# Altium project RK3399_SOM_BOARD.PrjPcb (part 2 of 4)

## Sheet RK3399_SDRAM.SchDoc
size A3; Date: 07.08.2025; CheckedBy: Own Check; CompanyName: No Company; DocumentNumber: ELK.PCB.0005.0005.A.A; Revision: V0.0.1; SheetNumber: 9; SheetTotal: 22
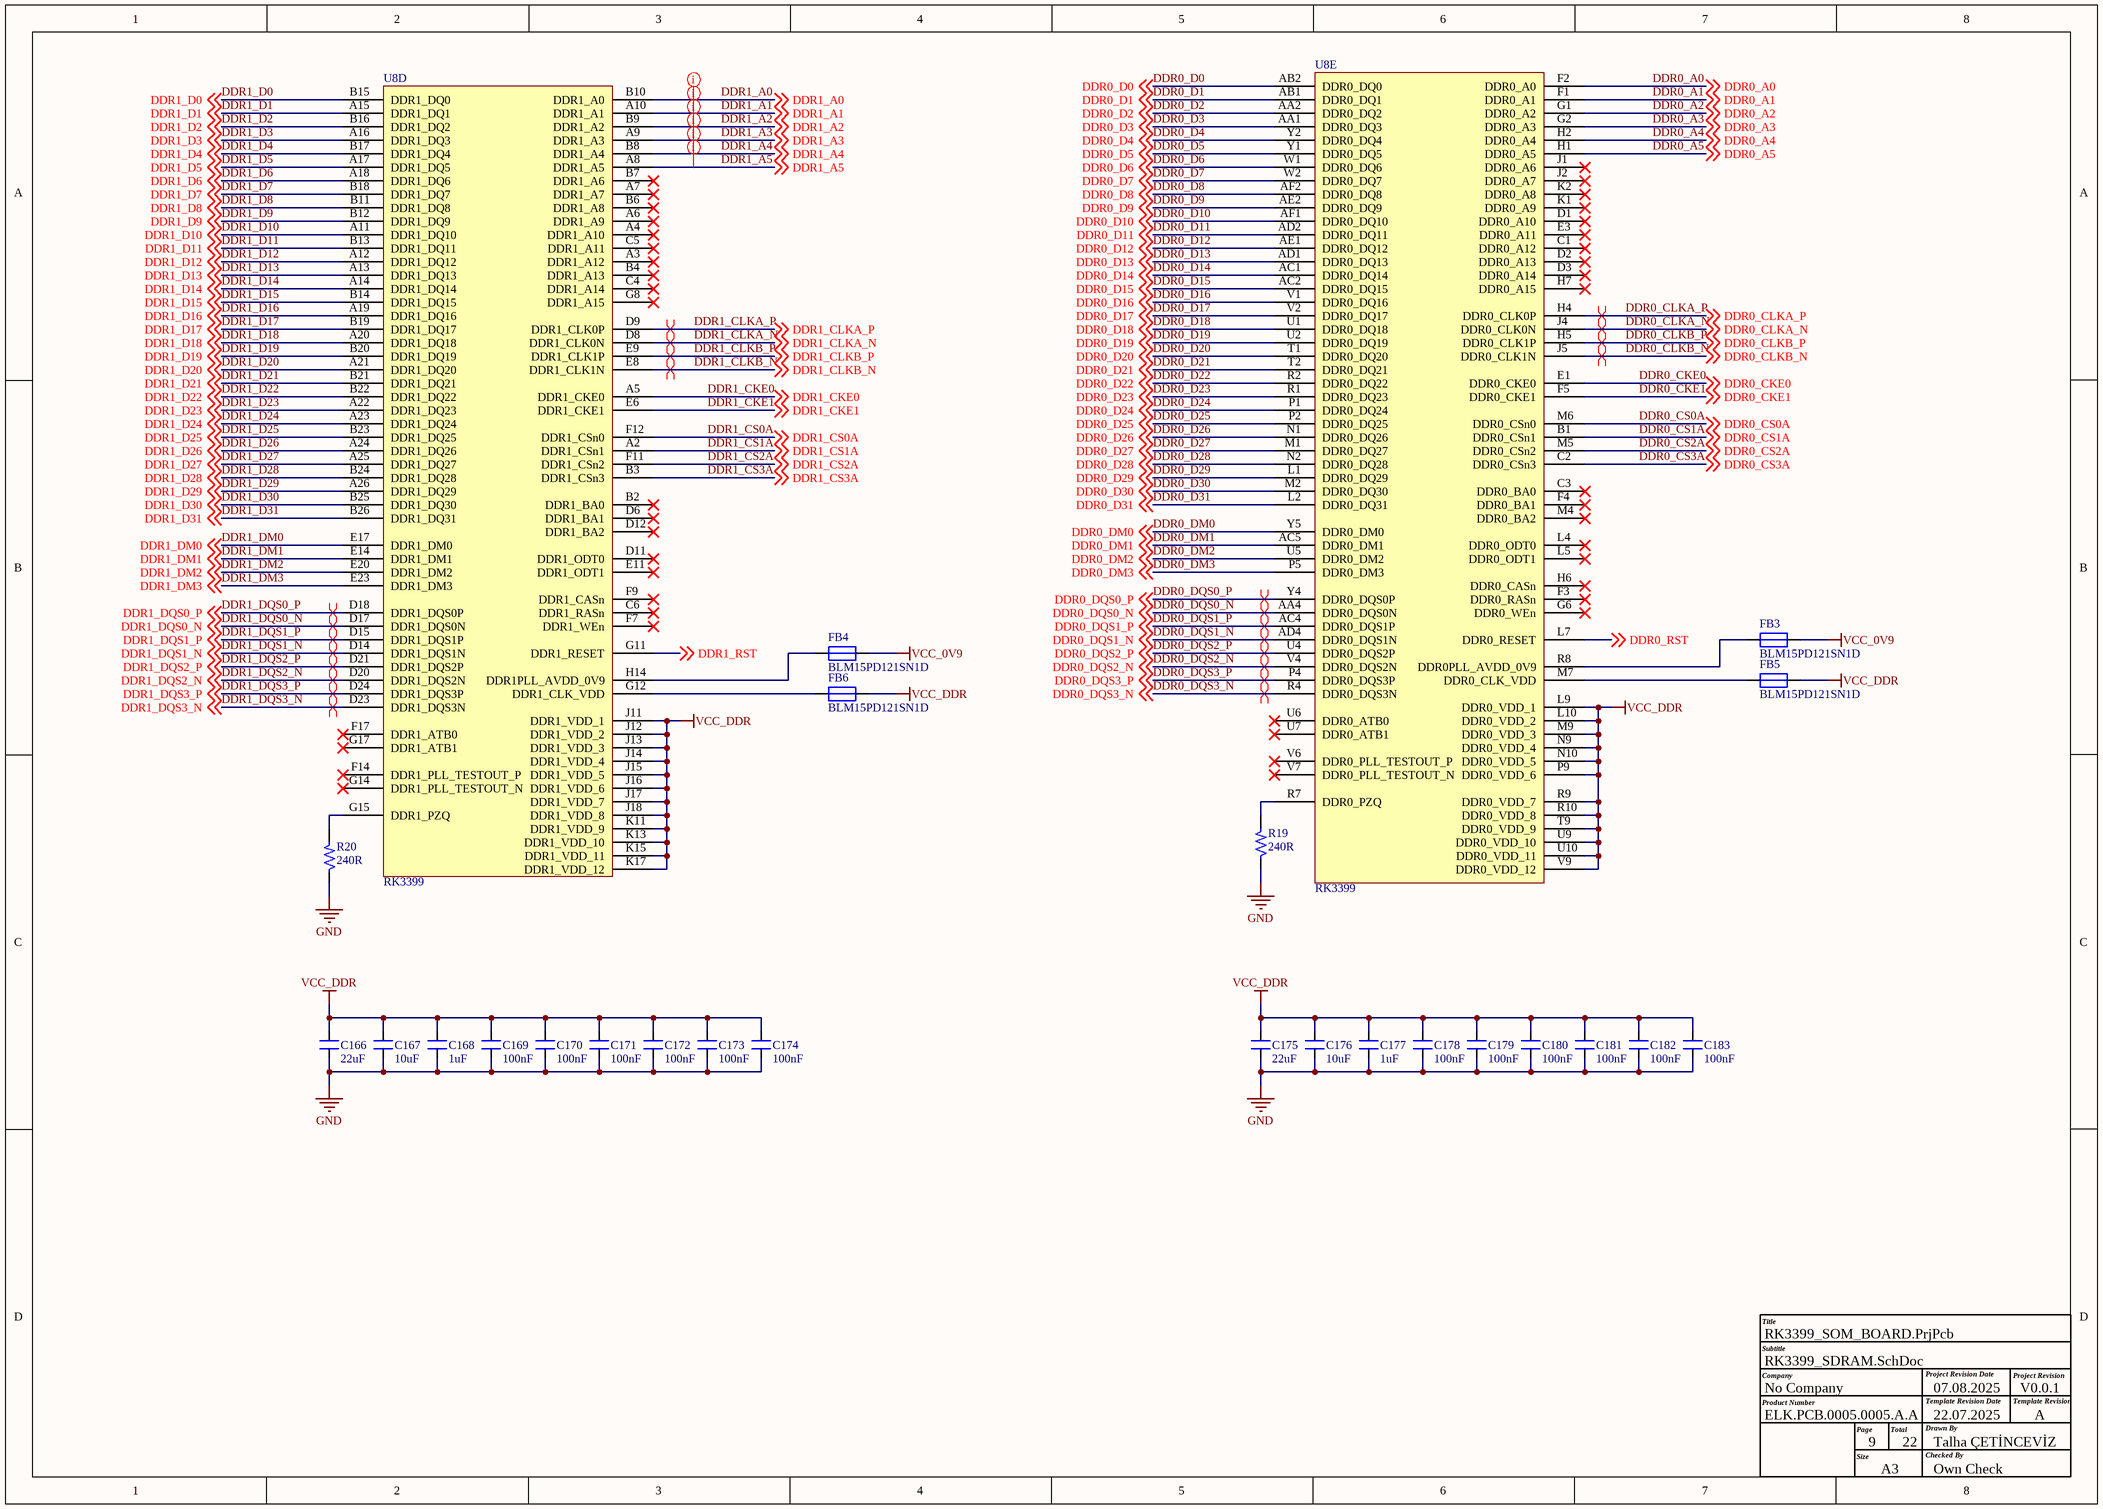
[diagram p7: RK3399_SDRAM.SchDoc]

### Parts
C166  22uF  [CAP_0402]
C167  10uF  [CAP_0402]
C168  1uF  [CAP_0201]
C169  100nF  [CAP_0201]
C170  100nF  [CAP_0201]
C171  100nF  [CAP_0201]
C172  100nF  [CAP_0201]
C173  100nF  [CAP_0201]
C174  100nF  [CAP_0201]
C175  22uF  [CAP_0402]
C176  10uF  [CAP_0402]
C177  1uF  [CAP_0201]
C178  100nF  [CAP_0201]
C179  100nF  [CAP_0201]
C180  100nF  [CAP_0201]
C181  100nF  [CAP_0201]
C182  100nF  [CAP_0201]
C183  100nF  [CAP_0201]
FB3  BLM15PD121SN1D  [RES_0402]
FB4  BLM15PD121SN1D  [RES_0402]
FB5  BLM15PD121SN1D  [RES_0402]
FB6  BLM15PD121SN1D  [RES_0402]
R19  240R  [RES_0201]
R20  240R  [RES_0201]
U8  RK3399  [FBGA828_23_826X826]  (parts D,E of 24)

### Nets
GND: C166.1 C167.1 C168.1 C169.1 C170.1 C171.1 C172.1 C173.1 C174.1 C175.1 C176.1 C177.1 C178.1 C179.1 C180.1 C181.1 C182.1 C183.1 R19.1 R20.1
VCC_0V9: FB3.2 FB4.2
VCC_DDR: C166.2 C167.2 C168.2 C169.2 C170.2 C171.2 C172.2 C173.2 C174.2 C175.2 C176.2 C177.2 C178.2 C179.2 C180.2 C181.2 C182.2 C183.2 FB5.2 FB6.2 U8.J11(DDR1_VDD_1) U8.J12(DDR1_VDD_2) U8.J13(DDR1_VDD_3) U8.J14(DDR1_VDD_4) U8.J15(DDR1_VDD_5) U8.J16(DDR1_VDD_6) U8.J17(DDR1_VDD_7) U8.J18(DDR1_VDD_8) U8.K11(DDR1_VDD_9) U8.K13(DDR1_VDD_10) U8.K15(DDR1_VDD_11) U8.K17(DDR1_VDD_12) U8.L9(DDR0_VDD_1) U8.L10(DDR0_VDD_2) U8.M9(DDR0_VDD_3) U8.N9(DDR0_VDD_4) U8.N10(DDR0_VDD_5) U8.P9(DDR0_VDD_6) U8.R9(DDR0_VDD_7) U8.R10(DDR0_VDD_8) U8.T9(DDR0_VDD_9) U8.U9(DDR0_VDD_10) U8.U10(DDR0_VDD_11) U8.V9(DDR0_VDD_12)
DDR0_A0: U8.F2(DDR0_A0) ; off-sheet DDR0_A0
DDR0_A1: U8.F1(DDR0_A1) ; off-sheet DDR0_A1
DDR0_A2: U8.G1(DDR0_A2) ; off-sheet DDR0_A2
DDR0_A3: U8.G2(DDR0_A3) ; off-sheet DDR0_A3
DDR0_A4: U8.H2(DDR0_A4) ; off-sheet DDR0_A4
DDR0_A5: U8.H1(DDR0_A5) ; off-sheet DDR0_A5
DDR0_CKE0: U8.E1(DDR0_CKE0) ; off-sheet DDR0_CKE0
DDR0_CKE1: U8.F5(DDR0_CKE1) ; off-sheet DDR0_CKE1
DDR0_CLKA_N: U8.J4(DDR0_CLK0N) ; off-sheet DDR0_CLKA_N
DDR0_CLKA_P: U8.H4(DDR0_CLK0P) ; off-sheet DDR0_CLKA_P
DDR0_CLKB_N: U8.J5(DDR0_CLK1N) ; off-sheet DDR0_CLKB_N
DDR0_CLKB_P: U8.H5(DDR0_CLK1P) ; off-sheet DDR0_CLKB_P
DDR0_CS0A: U8.M6(DDR0_CSn0) ; off-sheet DDR0_CS0A
DDR0_CS1A: U8.B1(DDR0_CSn1) ; off-sheet DDR0_CS1A
DDR0_CS2A: U8.M5(DDR0_CSn2) ; off-sheet DDR0_CS2A
DDR0_CS3A: U8.C2(DDR0_CSn3) ; off-sheet DDR0_CS3A
DDR0_D0: U8.AB2(DDR0_DQ0) ; off-sheet DDR0_D0
DDR0_D1: U8.AB1(DDR0_DQ1) ; off-sheet DDR0_D1
DDR0_D2: U8.AA2(DDR0_DQ2) ; off-sheet DDR0_D2
DDR0_D3: U8.AA1(DDR0_DQ3) ; off-sheet DDR0_D3
DDR0_D4: U8.Y2(DDR0_DQ4) ; off-sheet DDR0_D4
DDR0_D5: U8.Y1(DDR0_DQ5) ; off-sheet DDR0_D5
DDR0_D6: U8.W1(DDR0_DQ6) ; off-sheet DDR0_D6
DDR0_D7: U8.W2(DDR0_DQ7) ; off-sheet DDR0_D7
DDR0_D8: U8.AF2(DDR0_DQ8) ; off-sheet DDR0_D8
DDR0_D9: U8.AE2(DDR0_DQ9) ; off-sheet DDR0_D9
DDR0_D10: U8.AF1(DDR0_DQ10) ; off-sheet DDR0_D10
DDR0_D11: U8.AD2(DDR0_DQ11) ; off-sheet DDR0_D11
DDR0_D12: U8.AE1(DDR0_DQ12) ; off-sheet DDR0_D12
DDR0_D13: U8.AD1(DDR0_DQ13) ; off-sheet DDR0_D13
DDR0_D14: U8.AC1(DDR0_DQ14) ; off-sheet DDR0_D14
DDR0_D15: U8.AC2(DDR0_DQ15) ; off-sheet DDR0_D15
DDR0_D16: U8.V1(DDR0_DQ16) ; off-sheet DDR0_D16
DDR0_D17: U8.V2(DDR0_DQ17) ; off-sheet DDR0_D17
DDR0_D18: U8.U1(DDR0_DQ18) ; off-sheet DDR0_D18
DDR0_D19: U8.U2(DDR0_DQ19) ; off-sheet DDR0_D19
DDR0_D20: U8.T1(DDR0_DQ20) ; off-sheet DDR0_D20
DDR0_D21: U8.T2(DDR0_DQ21) ; off-sheet DDR0_D21
DDR0_D22: U8.R2(DDR0_DQ22) ; off-sheet DDR0_D22
DDR0_D23: U8.R1(DDR0_DQ23) ; off-sheet DDR0_D23
DDR0_D24: U8.P1(DDR0_DQ24) ; off-sheet DDR0_D24
DDR0_D25: U8.P2(DDR0_DQ25) ; off-sheet DDR0_D25
DDR0_D26: U8.N1(DDR0_DQ26) ; off-sheet DDR0_D26
DDR0_D27: U8.M1(DDR0_DQ27) ; off-sheet DDR0_D27
DDR0_D28: U8.N2(DDR0_DQ28) ; off-sheet DDR0_D28
DDR0_D29: U8.L1(DDR0_DQ29) ; off-sheet DDR0_D29
DDR0_D30: U8.M2(DDR0_DQ30) ; off-sheet DDR0_D30
DDR0_D31: U8.L2(DDR0_DQ31) ; off-sheet DDR0_D31
DDR0_DM0: U8.Y5(DDR0_DM0) ; off-sheet DDR0_DM0
DDR0_DM1: U8.AC5(DDR0_DM1) ; off-sheet DDR0_DM1
DDR0_DM2: U8.U5(DDR0_DM2) ; off-sheet DDR0_DM2
DDR0_DM3: U8.P5(DDR0_DM3) ; off-sheet DDR0_DM3
DDR0_DQS0_N: U8.AA4(DDR0_DQS0N) ; off-sheet DDR0_DQS0_N
DDR0_DQS0_P: U8.Y4(DDR0_DQS0P) ; off-sheet DDR0_DQS0_P
DDR0_DQS1_N: U8.AD4(DDR0_DQS1N) ; off-sheet DDR0_DQS1_N
DDR0_DQS1_P: U8.AC4(DDR0_DQS1P) ; off-sheet DDR0_DQS1_P
DDR0_DQS2_N: U8.V4(DDR0_DQS2N) ; off-sheet DDR0_DQS2_N
DDR0_DQS2_P: U8.U4(DDR0_DQS2P) ; off-sheet DDR0_DQS2_P
DDR0_DQS3_N: U8.R4(DDR0_DQS3N) ; off-sheet DDR0_DQS3_N
DDR0_DQS3_P: U8.P4(DDR0_DQS3P) ; off-sheet DDR0_DQS3_P
DDR0_RST: U8.L7(DDR0_RESET) ; off-sheet DDR0_RST
DDR1_A0: U8.B10(DDR1_A0) ; off-sheet DDR1_A0
DDR1_A1: U8.A10(DDR1_A1) ; off-sheet DDR1_A1
DDR1_A2: U8.B9(DDR1_A2) ; off-sheet DDR1_A2
DDR1_A3: U8.A9(DDR1_A3) ; off-sheet DDR1_A3
DDR1_A4: U8.B8(DDR1_A4) ; off-sheet DDR1_A4
DDR1_A5: U8.A8(DDR1_A5) ; off-sheet DDR1_A5
DDR1_CKE0: U8.A5(DDR1_CKE0) ; off-sheet DDR1_CKE0
DDR1_CKE1: U8.E6(DDR1_CKE1) ; off-sheet DDR1_CKE1
DDR1_CLKA_N: U8.D8(DDR1_CLK0N) ; off-sheet DDR1_CLKA_N
DDR1_CLKA_P: U8.D9(DDR1_CLK0P) ; off-sheet DDR1_CLKA_P
DDR1_CLKB_N: U8.E8(DDR1_CLK1N) ; off-sheet DDR1_CLKB_N
DDR1_CLKB_P: U8.E9(DDR1_CLK1P) ; off-sheet DDR1_CLKB_P
DDR1_CS0A: U8.F12(DDR1_CSn0) ; off-sheet DDR1_CS0A
DDR1_CS1A: U8.A2(DDR1_CSn1) ; off-sheet DDR1_CS1A
DDR1_CS2A: U8.F11(DDR1_CSn2) ; off-sheet DDR1_CS2A
DDR1_CS3A: U8.B3(DDR1_CSn3) ; off-sheet DDR1_CS3A
DDR1_D0: U8.B15(DDR1_DQ0) ; off-sheet DDR1_D0
DDR1_D1: U8.A15(DDR1_DQ1) ; off-sheet DDR1_D1
DDR1_D2: U8.B16(DDR1_DQ2) ; off-sheet DDR1_D2
DDR1_D3: U8.A16(DDR1_DQ3) ; off-sheet DDR1_D3
DDR1_D4: U8.B17(DDR1_DQ4) ; off-sheet DDR1_D4
DDR1_D5: U8.A17(DDR1_DQ5) ; off-sheet DDR1_D5
DDR1_D6: U8.A18(DDR1_DQ6) ; off-sheet DDR1_D6
DDR1_D7: U8.B18(DDR1_DQ7) ; off-sheet DDR1_D7
DDR1_D8: U8.B11(DDR1_DQ8) ; off-sheet DDR1_D8
DDR1_D9: U8.B12(DDR1_DQ9) ; off-sheet DDR1_D9
DDR1_D10: U8.A11(DDR1_DQ10) ; off-sheet DDR1_D10
DDR1_D11: U8.B13(DDR1_DQ11) ; off-sheet DDR1_D11
DDR1_D12: U8.A12(DDR1_DQ12) ; off-sheet DDR1_D12
DDR1_D13: U8.A13(DDR1_DQ13) ; off-sheet DDR1_D13
DDR1_D14: U8.A14(DDR1_DQ14) ; off-sheet DDR1_D14
DDR1_D15: U8.B14(DDR1_DQ15) ; off-sheet DDR1_D15
DDR1_D16: U8.A19(DDR1_DQ16) ; off-sheet DDR1_D16
DDR1_D17: U8.B19(DDR1_DQ17) ; off-sheet DDR1_D17
DDR1_D18: U8.A20(DDR1_DQ18) ; off-sheet DDR1_D18
DDR1_D19: U8.B20(DDR1_DQ19) ; off-sheet DDR1_D19
DDR1_D20: U8.A21(DDR1_DQ20) ; off-sheet DDR1_D20
DDR1_D21: U8.B21(DDR1_DQ21) ; off-sheet DDR1_D21
DDR1_D22: U8.B22(DDR1_DQ22) ; off-sheet DDR1_D22
DDR1_D23: U8.A22(DDR1_DQ23) ; off-sheet DDR1_D23
DDR1_D24: U8.A23(DDR1_DQ24) ; off-sheet DDR1_D24
DDR1_D25: U8.B23(DDR1_DQ25) ; off-sheet DDR1_D25
DDR1_D26: U8.A24(DDR1_DQ26) ; off-sheet DDR1_D26
DDR1_D27: U8.A25(DDR1_DQ27) ; off-sheet DDR1_D27
DDR1_D28: U8.B24(DDR1_DQ28) ; off-sheet DDR1_D28
DDR1_D29: U8.A26(DDR1_DQ29) ; off-sheet DDR1_D29
DDR1_D30: U8.B25(DDR1_DQ30) ; off-sheet DDR1_D30
DDR1_D31: U8.B26(DDR1_DQ31) ; off-sheet DDR1_D31
DDR1_DM0: U8.E17(DDR1_DM0) ; off-sheet DDR1_DM0
DDR1_DM1: U8.E14(DDR1_DM1) ; off-sheet DDR1_DM1
DDR1_DM2: U8.E20(DDR1_DM2) ; off-sheet DDR1_DM2
DDR1_DM3: U8.E23(DDR1_DM3) ; off-sheet DDR1_DM3
DDR1_DQS0_N: U8.D17(DDR1_DQS0N) ; off-sheet DDR1_DQS0_N
DDR1_DQS0_P: U8.D18(DDR1_DQS0P) ; off-sheet DDR1_DQS0_P
DDR1_DQS1_N: U8.D14(DDR1_DQS1N) ; off-sheet DDR1_DQS1_N
DDR1_DQS1_P: U8.D15(DDR1_DQS1P) ; off-sheet DDR1_DQS1_P
DDR1_DQS2_N: U8.D20(DDR1_DQS2N) ; off-sheet DDR1_DQS2_N
DDR1_DQS2_P: U8.D21(DDR1_DQS2P) ; off-sheet DDR1_DQS2_P
DDR1_DQS3_N: U8.D23(DDR1_DQS3N) ; off-sheet DDR1_DQS3_N
DDR1_DQS3_P: U8.D24(DDR1_DQS3P) ; off-sheet DDR1_DQS3_P
DDR1_RST: U8.G11(DDR1_RESET) ; off-sheet DDR1_RST
NetFB3_1: FB3.1 U8.R8(DDR0PLL_AVDD_0V9)
NetFB4_1: FB4.1 U8.H14(DDR1PLL_AVDD_0V9)
NetFB5_1: FB5.1 U8.M7(DDR0_CLK_VDD)
NetFB6_1: FB6.1 U8.G12(DDR1_CLK_VDD)
NetR19_2: R19.2 U8.R7(DDR0_PZQ)
NetR20_2: R20.2 U8.G15(DDR1_PZQ)

Not connected (* = marked no-connect by the designer): U8 A3(DDR1_A12)* A4(DDR1_A10)* A6(DDR1_A9)* A7(DDR1_A7)* B2(DDR1_BA0)* B4(DDR1_A13)* B6(DDR1_A8)* B7(DDR1_A6)* C1(DDR0_A12)* C3(DDR0_BA0)* C4(DDR1_A14)* C5(DDR1_A11)* C6(DDR1_RASn)* D1(DDR0_A10)* D2(DDR0_A13)* D3(DDR0_A14)* D6(DDR1_BA1)* D11(DDR1_ODT0)* D12(DDR1_BA2)* E3(DDR0_A11)* E11(DDR1_ODT1)* F3(DDR0_RASn)* F4(DDR0_BA1)* F7(DDR1_WEn)* F9(DDR1_CASn)* F14(DDR1_PLL_TESTOUT_P)* F17(DDR1_ATB0)* G6(DDR0_WEn)* G8(DDR1_A15)* G14(DDR1_PLL_TESTOUT_N)* G17(DDR1_ATB1)* H6(DDR0_CASn)* H7(DDR0_A15)* J1(DDR0_A6)* J2(DDR0_A7)* K1(DDR0_A9)* K2(DDR0_A8)* L4(DDR0_ODT0)* L5(DDR0_ODT1)* M4(DDR0_BA2)* U6(DDR0_ATB0)* U7(DDR0_ATB1)* V6(DDR0_PLL_TESTOUT_P)* V7(DDR0_PLL_TESTOUT_N)*

### Layout directives
differential pair; differential pair class DIFF100_DDR_DQS: DDR0_DQS0_N, DDR0_DQS0_P, DDR0_DQS1_N, DDR0_DQS1_P, DDR0_DQS2_N, DDR0_DQS2_P, DDR0_DQS3_N, DDR0_DQS3_P, DDR1_DQS0_N, DDR1_DQS0_P, DDR1_DQS1_N, DDR1_DQS1_P, DDR1_DQS2_N, DDR1_DQS2_P, DDR1_DQS3_N, DDR1_DQS3_P
differential pair; differential pair class DIFF100_DDR_CLK: DDR0_CLKA_N, DDR0_CLKA_P, DDR0_CLKB_N, DDR0_CLKB_P, DDR1_CLKA_N, DDR1_CLKA_P, DDR1_CLKB_N, DDR1_CLKB_P
net class 50OHM_DDR_A: DDR1_A0, DDR1_A1, DDR1_A2, DDR1_A3, DDR1_A4, DDR1_A5

### Notes on the sheet
- Title
- Company
- Product Number
- Subtitle
- Project Revision Date
- Template Revision Date
- Project Revision
- Template Revision
- Size
- Page
- A3
- Total
- Checked By
- Drawn By
- 22.07.2025
- Talha ÇETİNCEVİZ
- A

### Library data of the parts
C166 C175 = CAP_22uF-6.3V-20%-0402: 22µF ±20% 6.3V Ceramic Capacitor X5R 0402 (1005 Metric); Manufacturer: Murata Electronics; Manufacturer Part Number: CL05A226MQ5N6J8; Case/Package: 0402; Supplier-1: Digikey
C167 C176 = CAP_10uF-10V-20%-0402: 10µF ±20% 10V Ceramic Capacitor X5R 0402 (1005 Metric); Manufacturer Part Number: CL05A106MP5NUNC; Manufacturer: Samsung Electro-Mechanics; Case/Package: 0402; Supplier-1: Digikey
C168 C177 = CAP_1uF-16V-10%-0201: as C3 on sheet LPDDR4 SDRAM-1; Case/Package: 0201; Supplier-1: Digikey
C169-C174 C178-C183 = CAP_100nF-25V-10%-0201: as C4 on sheet LPDDR4 SDRAM-1; Case/Package: 0201; Supplier-1: Digikey
FB3-FB6 = FB_120R-1.3A-100Mhz-0402: as FB1 on sheet LPDDR4 SDRAM-1; Mnaufacturer Part Number: BLM15PD121SN1D; Case/Package: 0402; Supplier-1: Digikey
R19 R20 = RES_240R-0.05W-1%-0201: 240 Ohms ±1% 0.05W, 1/20W Chip Resistor 0201 (0603 Metric) Thick Film; Manufacturer: Yageo; Manufacturer Part Number: RC0201FR-07240RL; Case/Package: 0201; Supplier-1: Digikey
U8 = IC_RK3399-FCBGA828: as U8 on sheet RK3399_Power_Pins; Manufacturer Part Number: RK3399; Case/Package: FCBGA828; Supplier-1: Rockchip

## Sheet RK3399_PMU.SchDoc
size A4; Date: 07.08.2025; CheckedBy: Own Check; CompanyName: No Company; DocumentNumber: ELK.PCB.0005.0005.A.A; Revision: V0.0.1; SheetNumber: 10; SheetTotal: 22
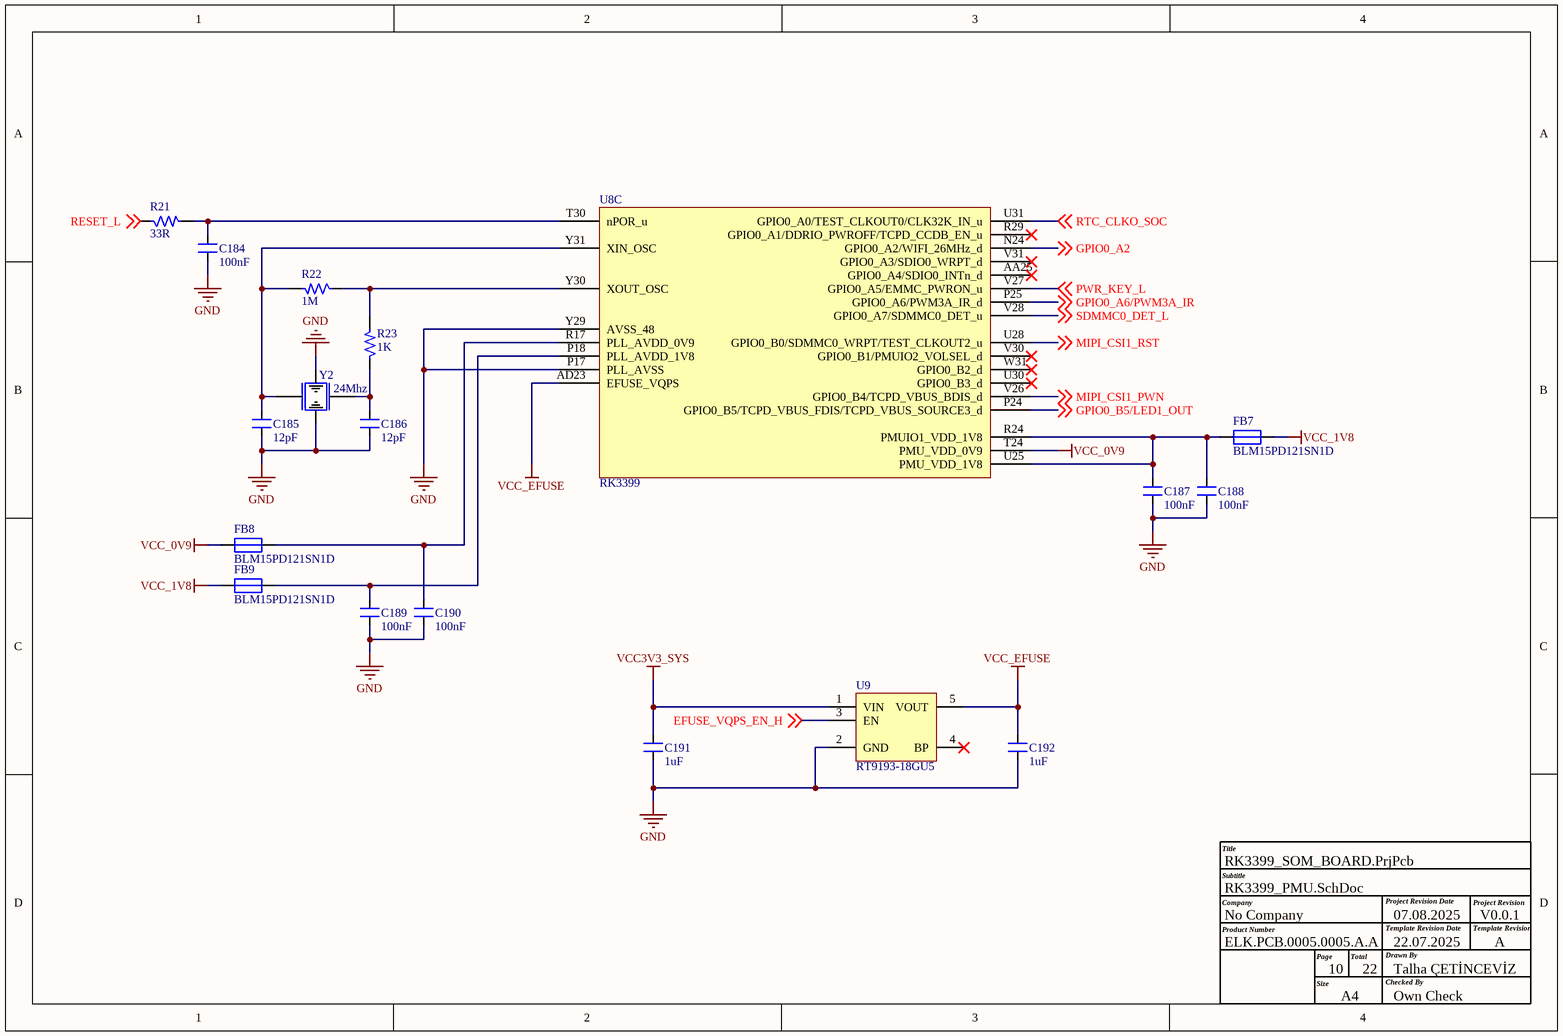
[diagram p8: RK3399_PMU.SchDoc]

### Parts
C184  100nF  [CAP_0201]
C185  12pF  [CAP_0201]
C186  12pF  [CAP_0201]
C187  100nF  [CAP_0201]
C188  100nF  [CAP_0201]
C189  100nF  [CAP_0201]
C190  100nF  [CAP_0201]
C191  1uF  [CAP_0201]
C192  1uF  [CAP_0201]
FB7  BLM15PD121SN1D  [RES_0402]
FB8  BLM15PD121SN1D  [RES_0402]
FB9  BLM15PD121SN1D  [RES_0402]
R21  33R  [RES_0201]
R22  1M  [RES_0201]
R23  1K  [RES_0201]
U8  RK3399  [FBGA828_23_826X826]  (part C of 24)
U9  RT9193-18GU5  [SC70-5]
Y2  24Mhz  [XTAL_ABM8AIG-24.000MHZ-12-2Z-T3]

### Nets
GND: C184.1 C185.1 C186.1 C187.1 C188.1 C189.1 C190.1 C191.1 C192.1 U8.P17(PLL_AVSS) U8.Y29(AVSS_48) U9.2(GND) Y2.2 Y2.4
VCC3V3_SYS: C191.2 U9.1(VIN)
VCC_0V9: FB8.1 U8.T24(PMU_VDD_0V9)
VCC_1V8: FB7.2 FB9.1
VCC_EFUSE: C192.2 U8.AD23(EFUSE_VQPS) U9.5(VOUT)
EFUSE_VQPS_EN_H: U9.3(EN) ; off-sheet EFUSE_VQPS_EN_H
GPIO0_A2: U8.N24(GPIO0_A2/WIFI_26MHz_d) ; off-sheet GPIO0_A2
GPIO0_A6/PWM3A_IR: U8.P25(GPIO0_A6/PWM3A_IR_d) ; off-sheet GPIO0_A6/PWM3A_IR
GPIO0_B5/LED1_OUT: U8.P24(GPIO0_B5/TCPD_VBUS_FDIS/TCPD_VBUS_SOURCE3_d) ; off-sheet GPIO0_B5/LED1_OUT
MIPI_CSI1_PWN: U8.V26(GPIO0_B4/TCPD_VBUS_BDIS_d) ; off-sheet MIPI_CSI1_PWN
MIPI_CSI1_RST: U8.U28(GPIO0_B0/SDMMC0_WRPT/TEST_CLKOUT2_u) ; off-sheet MIPI_CSI1_RST
PWR_KEY_L: U8.V27(GPIO0_A5/EMMC_PWRON_u) ; off-sheet PWR_KEY_L
RESET_L: R21.1 ; off-sheet RESET_L
RTC_CLKO_SOC: U8.U31(GPIO0_A0/TEST_CLKOUT0/CLK32K_IN_u) ; off-sheet RTC_CLKO_SOC
SDMMC0_DET_L: U8.V28(GPIO0_A7/SDMMC0_DET_u) ; off-sheet SDMMC0_DET_L
NetC184_2: C184.2 R21.2 U8.T30(nPOR_u)
NetC185_2: C185.2 R22.2 U8.Y31(XIN_OSC) Y2.1
NetC186_2: C186.2 R23.1 Y2.3
NetC187_2: C187.2 C188.2 FB7.1 U8.R24(PMUIO1_VDD_1V8) U8.U25(PMU_VDD_1V8)
NetC189_2: C189.2 FB9.2 U8.P18(PLL_AVDD_1V8)
NetC190_2: C190.2 FB8.2 U8.R17(PLL_AVDD_0V9)
NetR22_1: R22.1 R23.2 U8.Y30(XOUT_OSC)

Not connected (* = marked no-connect by the designer): U8 AA25(GPIO0_A4/SDIO0_INTn_d)* R29(GPIO0_A1/DDRIO_PWROFF/TCPD_CCDB_EN_u)* U30(GPIO0_B3_d)* V30(GPIO0_B1/PMUIO2_VOLSEL_d)* V31(GPIO0_A3/SDIO0_WRPT_d)* W31(GPIO0_B2_d)*; U9 4(BP)*

### Notes on the sheet
- Title
- Company
- Product Number
- Subtitle
- Project Revision Date
- Template Revision Date
- Project Revision
- Template Revision
- Size
- Page
- A4
- Total
- Checked By
- Drawn By
- 22.07.2025
- Talha ÇETİNCEVİZ
- A

### Library data of the parts
C184 C187-C190 = CAP_100nF-25V-10%-0201: 0.1µF ±10% 25V Ceramic Capacitor X5R 0201 (0603 Metric); Manufacturer: TDK Corporation; Manufacturer Part Number: C0603X5R1E104K030BB; Case/Package: 0201; Supplier-1: Digikey
C185 C186 = CAP_12pF-16V-10%-0201: 12pF ±10% 16V Ceramic Capacitor C0G, NP0 0201 (0603 Metric); Manufacturer: AVX Corporation; Manufacturer Part Number: 0201YA120KAT2A; Case/Package: 0201; Supplier-1: Digikey
C191 C192 = CAP_1uF-16V-10%-0201: 1µF ±20% 16V Ceramic Capacitor X5R 0201 (0603 Metric); Manufacturer: Samsung Electro-Mechanics; Manufacturer Part Number: CL03A105MO3NRNH; Case/Package: 0201; Supplier-1: Digikey
FB7-FB9 = FB_120R-1.3A-100Mhz-0402: 120 Ohms @ 100MHz 1 Power Line Ferrite Bead 0402 (1005 Metric) 1.3A 90mOhm; Manufacturer: Murata Electronics; Mnaufacturer Part Number: BLM15PD121SN1D; Case/Package: 0402; Supplier-1: Digikey
R21 = RES_33R-0.05W-1%-0201: 33 Ohms ±1% 0.05W, 1/20W Chip Resistor 0201 (0603 Metric) Thick Film; Manufacturer: Yageo; Manufacturer Part Number: RC0201FR-0733RL; Case/Package: 0201; Supplier-1: Digikey
R22 = RES_1M-0.05W-1%-0201: 1 MOhms ±1% 0.05W, 1/20W Chip Resistor 0201 (0603 Metric) Thick Film; Manufacturer: Yageo; Manufacturer Part Number: RC0201FR-071ML; Case/Package: 0201; Supplier-1: Digikey
R23 = RES_1K-0.05W-1%-0201: 1 kOhms ±1% 0.05W, 1/20W Chip Resistor 0201 (0603 Metric) Thick Film; Manufacturer: Yageo; Manufacturer Part Number: RC0201FR-071KL; Case/Package: 0201; Supplier-1: Digikey
U8 = IC_RK3399-FCBGA828: RK3399 is a low power, high performance processor for computing, personal mobile.; Manufacturer: Rockchip; Manufacturer Part Number: RK3399; Case/Package: FCBGA828; Supplier-1: Rockchip
U9 = REG_1.8V-300mA-5.5V-SC70-5: Linear Voltage Regulator IC 1 Output 300mA SC-70-5; Manufacturer: Richtek USA Inc.; Manufacturer Part Number: RT9193-18GU5; Case/Package: SC70-5; Supplier-1: Digikey
Y2 = XTAL_24Mhz-12pF-4-SMD: 24MHz ±20ppm Crystal 12pF 50 Ohms 4-SMD, No Lead; Manufacturer: Abracon LLC; Manufacturer Part Number: ABM8AIG-24.000MHZ-12-2Z-T3; Case/Package: SMD; Supplier-1: Digikey

## Sheet RK3399_EMMC_ADC_PCIE.SchDoc
size A4; Date: 07.08.2025; CheckedBy: Own Check; CompanyName: No Company; DocumentNumber: ELK.PCB.0005.0005.A.A; Revision: V0.0.1; SheetNumber: 11; SheetTotal: 22
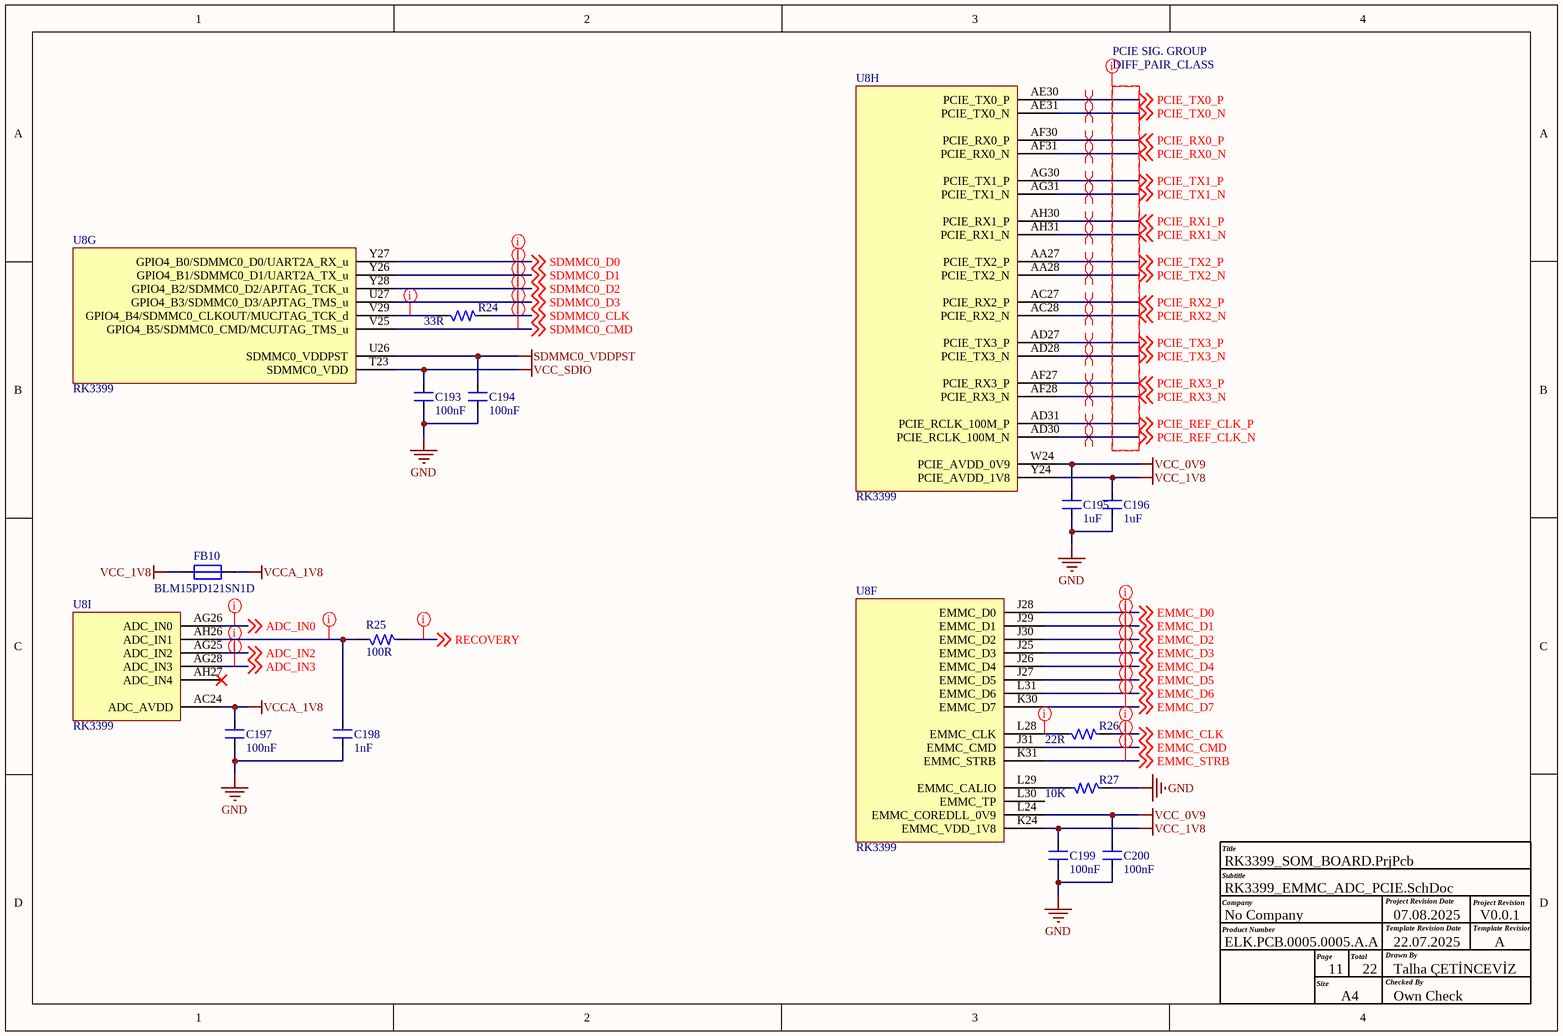
[diagram p9: RK3399_EMMC_ADC_PCIE.SchDoc]

### Parts
C193  100nF  [CAP_0201]
C194  100nF  [CAP_0201]
C195  1uF  [CAP_0201]
C196  1uF  [CAP_0201]
C197  100nF  [CAP_0201]
C198  1nF  [CAP_0201]
C199  100nF  [CAP_0201]
C200  100nF  [CAP_0201]
FB10  BLM15PD121SN1D  [RES_0402]
R24  33R  [RES_0201]
R25  100R  [RES_0201]
R26  22R  [RES_0201]
R27  10K  [RES_0201]
U8  RK3399  [FBGA828_23_826X826]  (parts F,G,H,I of 24)

### Nets
GND: C193.1 C194.1 C195.1 C196.1 C197.1 C198.1 C199.1 C200.1 R27.1
SDMMC0_VDDPST: C194.2 U8.U26(SDMMC0_VDDPST)
VCC_0V9: C195.2 C200.2 U8.L24(EMMC_COREDLL_0V9) U8.W24(PCIE_AVDD_0V9)
VCC_1V8: C196.2 C199.2 FB10.1 U8.K24(EMMC_VDD_1V8) U8.Y24(PCIE_AVDD_1V8)
VCC_SDIO: C193.2 U8.T23(SDMMC0_VDD)
VCCA_1V8: C197.2 FB10.2 U8.AC24(ADC_AVDD)
ADC_IN0: U8.AG26(ADC_IN0) ; off-sheet ADC_IN0
ADC_IN2: U8.AG25(ADC_IN2) ; off-sheet ADC_IN2
ADC_IN3: U8.AG28(ADC_IN3) ; off-sheet ADC_IN3
EMMC_CLK: R26.2 ; off-sheet EMMC_CLK
EMMC_CMD: U8.J31(EMMC_CMD) ; off-sheet EMMC_CMD
EMMC_D0: U8.J28(EMMC_D0) ; off-sheet EMMC_D0
EMMC_D1: U8.J29(EMMC_D1) ; off-sheet EMMC_D1
EMMC_D2: U8.J30(EMMC_D2) ; off-sheet EMMC_D2
EMMC_D3: U8.J25(EMMC_D3) ; off-sheet EMMC_D3
EMMC_D4: U8.J26(EMMC_D4) ; off-sheet EMMC_D4
EMMC_D5: U8.J27(EMMC_D5) ; off-sheet EMMC_D5
EMMC_D6: U8.L31(EMMC_D6) ; off-sheet EMMC_D6
EMMC_D7: U8.K30(EMMC_D7) ; off-sheet EMMC_D7
EMMC_STRB: U8.K31(EMMC_STRB) ; off-sheet EMMC_STRB
PCIE_REF_CLK_N: U8.AD30(PCIE_RCLK_100M_N) ; off-sheet PCIE_REF_CLK_N
PCIE_REF_CLK_P: U8.AD31(PCIE_RCLK_100M_P) ; off-sheet PCIE_REF_CLK_P
PCIE_RX0_N: U8.AF31(PCIE_RX0_N) ; off-sheet PCIE_RX0_N
PCIE_RX0_P: U8.AF30(PCIE_RX0_P) ; off-sheet PCIE_RX0_P
PCIE_RX1_N: U8.AH31(PCIE_RX1_N) ; off-sheet PCIE_RX1_N
PCIE_RX1_P: U8.AH30(PCIE_RX1_P) ; off-sheet PCIE_RX1_P
PCIE_RX2_N: U8.AC28(PCIE_RX2_N) ; off-sheet PCIE_RX2_N
PCIE_RX2_P: U8.AC27(PCIE_RX2_P) ; off-sheet PCIE_RX2_P
PCIE_RX3_N: U8.AF28(PCIE_RX3_N) ; off-sheet PCIE_RX3_N
PCIE_RX3_P: U8.AF27(PCIE_RX3_P) ; off-sheet PCIE_RX3_P
PCIE_TX0_N: U8.AE31(PCIE_TX0_N) ; off-sheet PCIE_TX0_N
PCIE_TX0_P: U8.AE30(PCIE_TX0_P) ; off-sheet PCIE_TX0_P
PCIE_TX1_N: U8.AG31(PCIE_TX1_N) ; off-sheet PCIE_TX1_N
PCIE_TX1_P: U8.AG30(PCIE_TX1_P) ; off-sheet PCIE_TX1_P
PCIE_TX2_N: U8.AA28(PCIE_TX2_N) ; off-sheet PCIE_TX2_N
PCIE_TX2_P: U8.AA27(PCIE_TX2_P) ; off-sheet PCIE_TX2_P
PCIE_TX3_N: U8.AD28(PCIE_TX3_N) ; off-sheet PCIE_TX3_N
PCIE_TX3_P: U8.AD27(PCIE_TX3_P) ; off-sheet PCIE_TX3_P
RECOVERY: R25.2 ; off-sheet RECOVERY
SDMMC0_CLK: R24.2 ; off-sheet SDMMC0_CLK
SDMMC0_CMD: U8.V25(GPIO4_B5/SDMMC0_CMD/MCUJTAG_TMS_u) ; off-sheet SDMMC0_CMD
SDMMC0_D0: U8.Y27(GPIO4_B0/SDMMC0_D0/UART2A_RX_u) ; off-sheet SDMMC0_D0
SDMMC0_D1: U8.Y26(GPIO4_B1/SDMMC0_D1/UART2A_TX_u) ; off-sheet SDMMC0_D1
SDMMC0_D2: U8.Y28(GPIO4_B2/SDMMC0_D2/APJTAG_TCK_u) ; off-sheet SDMMC0_D2
SDMMC0_D3: U8.U27(GPIO4_B3/SDMMC0_D3/APJTAG_TMS_u) ; off-sheet SDMMC0_D3
NetC198_2: C198.2 R25.1 U8.AH26(ADC_IN1)
NetR24_1: R24.1 U8.V29(GPIO4_B4/SDMMC0_CLKOUT/MUCJTAG_TCK_d)
NetR26_1: R26.1 U8.L28(EMMC_CLK)
NetR27_2: R27.2 U8.L29(EMMC_CALIO)

Not connected (* = marked no-connect by the designer): U8 AH27(ADC_IN4)* L30(EMMC_TP)

### Layout directives
net class ADC SIG. GROUP: ADC_IN0, ADC_IN2, ADC_IN3, NetC198_2, RECOVERY
net class 50OHM_SDMMC: NetR24_1, SDMMC0_CLK, SDMMC0_CMD, SDMMC0_D0, SDMMC0_D1, SDMMC0_D2, SDMMC0_D3
net class PCIE SIG. GROUP; net class DIFF_PAIR_CLASS: PCIE_REF_CLK_N, PCIE_REF_CLK_P, PCIE_RX0_N, PCIE_RX0_P, PCIE_RX1_N, PCIE_RX1_P, PCIE_RX2_N, PCIE_RX2_P, PCIE_RX3_N, PCIE_RX3_P, PCIE_TX0_N, PCIE_TX0_P, PCIE_TX1_N, PCIE_TX1_P, PCIE_TX2_N, PCIE_TX2_P, PCIE_TX3_N, PCIE_TX3_P
differential pair; differential pair class DIFF100_PCIE: PCIE_REF_CLK_N, PCIE_REF_CLK_P, PCIE_RX0_N, PCIE_RX0_P, PCIE_RX1_N, PCIE_RX1_P, PCIE_RX2_N, PCIE_RX2_P, PCIE_RX3_N, PCIE_RX3_P, PCIE_TX0_N, PCIE_TX0_P, PCIE_TX1_N, PCIE_TX1_P, PCIE_TX2_N, PCIE_TX2_P, PCIE_TX3_N, PCIE_TX3_P
net class 50OHM_EMMC: EMMC_CLK, EMMC_CMD, EMMC_D0, EMMC_D1, EMMC_D2, EMMC_D3, EMMC_D4, EMMC_D5, EMMC_D6, EMMC_D7, EMMC_STRB, NetR26_1

### Notes on the sheet
- Title
- Company
- Product Number
- Subtitle
- Project Revision Date
- Template Revision Date
- Project Revision
- Template Revision
- Size
- Page
- A4
- Total
- Checked By
- Drawn By
- 22.07.2025
- Talha ÇETİNCEVİZ
- A

### Library data of the parts
C193 C194 C197 C199 C200 = CAP_100nF-25V-10%-0201: as C184 on sheet RK3399_PMU; Case/Package: 0201; Supplier-1: Digikey
C195 C196 = CAP_1uF-16V-10%-0201: as C191 on sheet RK3399_PMU; Case/Package: 0201; Supplier-1: Digikey
C198 = CAP_1nF-16V-10%-0201: 1000pF ±10% 16V Ceramic Capacitor X7R 0201 (0603 Metric); Manufacturer: Murata Electronics; Manufacturer Part Number: GRM033R71C102KA01D; Case/Package: 0201; Supplier-1: Digikey
FB10 = FB_120R-1.3A-100Mhz-0402: as FB7-FB9 on sheet RK3399_PMU; Mnaufacturer Part Number: BLM15PD121SN1D; Case/Package: 0402; Supplier-1: Digikey
R24 = RES_33R-0.05W-1%-0201: as R21 on sheet RK3399_PMU; Case/Package: 0201; Supplier-1: Digikey
R25 = RES_100R-0.05W-1%-0201: 100 kOhms ±1% 0.05W, 1/20W Chip Resistor 0201 (0603 Metric) Automotive AEC-Q200 Thick Film; Manufacturer: Panasonic Electronic Components; Manufacturer Part Number: ERJ-1GNF1003C; Case/Package: 0201; Supplier-1: Digikey
R26 = RES_22R-0.05W-1%-0201: 22 Ohms ±1% 0.05W, 1/20W Chip Resistor 0201 (0603 Metric) Moisture Resistant Thick Film; Manufacturer: Yageo; Manufacturer Part Number: RC0201FR-0722RL; Case/Package: 0201; Supplier-1: Digikey
R27 = RES_10K-0.05W-1%-0201: 10 kOhms ±1% 0.05W, 1/20W Chip Resistor 0201 (0603 Metric) Thick Film; Manufacturer: Stackpole Electronics Inc; Manufacturer Part Number: RMCF0201FT10K0; Case/Package: 0201; Supplier-1: Digikey
U8 = IC_RK3399-FCBGA828: as U8 on sheet RK3399_PMU; Manufacturer Part Number: RK3399; Case/Package: FCBGA828; Supplier-1: Rockchip

## Sheet RK3399_EDP_CSI_HDMI.SchDoc
size A4; Date: 07.08.2025; CheckedBy: Own Check; CompanyName: No Company; DocumentNumber: ELK.PCB.0005.0005.A.A; Revision: V0.0.1; SheetNumber: 12; SheetTotal: 22
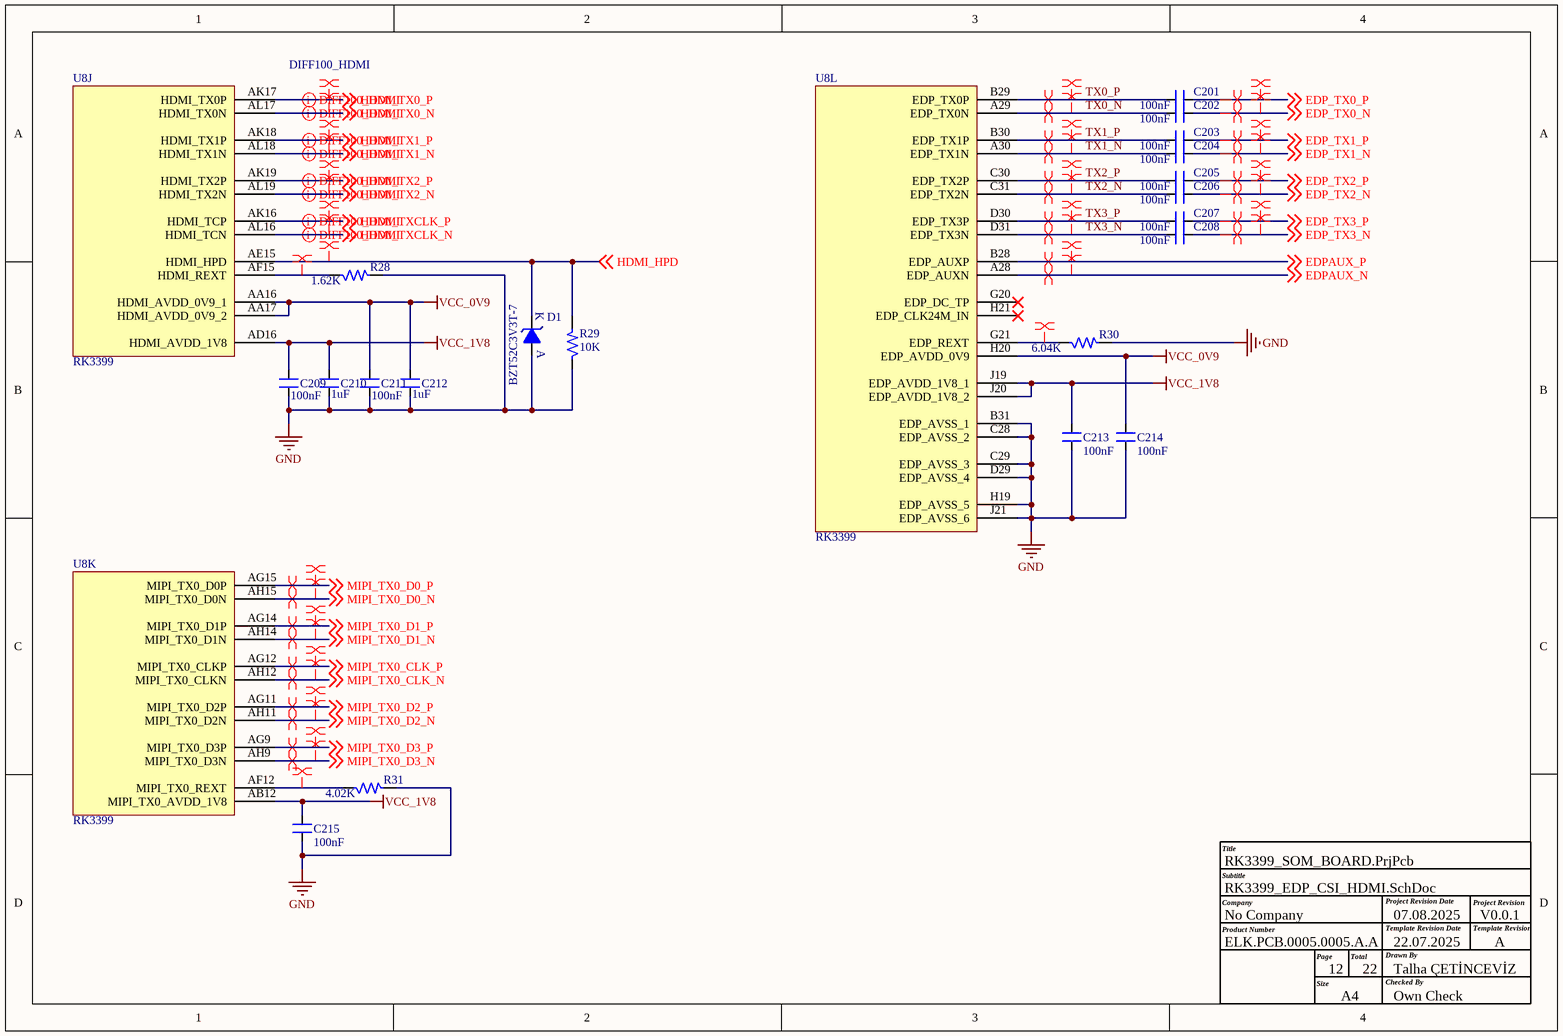
[diagram p10: RK3399_EDP_CSI_HDMI.SchDoc]

### Parts
C201  100nF  [CAP_0201]
C202  100nF  [CAP_0201]
C203  100nF  [CAP_0201]
C204  100nF  [CAP_0201]
C205  100nF  [CAP_0201]
C206  100nF  [CAP_0201]
C207  100nF  [CAP_0201]
C208  100nF  [CAP_0201]
C209  100nF  [CAP_0201]
C210  1uF  [CAP_0201]
C211  100nF  [CAP_0201]
C212  1uF  [CAP_0201]
C213  100nF  [CAP_0201]
C214  100nF  [CAP_0201]
C215  100nF  [CAP_0201]
D1  BZT52C3V3T-7  [DIO_SOD523]
R28  1.62K  [RES_0201]
R29  10K  [RES_0201]
R30  6.04K  [RES_0201]
R31  4.02K  [RES_0201]
U8  RK3399  [FBGA828_23_826X826]  (parts J,K,L of 24)

### Nets
GND: C209.1 C210.1 C211.1 C212.1 C213.1 C214.1 C215.1 D1.A R28.2 R29.1 R30.2 R31.2 U8.B31(EDP_AVSS_1) U8.C28(EDP_AVSS_2) U8.C29(EDP_AVSS_3) U8.D29(EDP_AVSS_4) U8.H19(EDP_AVSS_5) U8.J21(EDP_AVSS_6)
VCC_0V9: C211.2 C212.2 C214.2 U8.AA16(HDMI_AVDD_0V9_1) U8.AA17(HDMI_AVDD_0V9_2) U8.H20(EDP_AVDD_0V9)
VCC_1V8: C209.2 C210.2 C213.2 C215.2 U8.AB12(MIPI_TX0_AVDD_1V8) U8.AD16(HDMI_AVDD_1V8) U8.J19(EDP_AVDD_1V8_1) U8.J20(EDP_AVDD_1V8_2)
EDP_TX0_N: C202.2 ; off-sheet EDP_TX0_N
EDP_TX0_P: C201.2 ; off-sheet EDP_TX0_P
EDP_TX1_N: C204.2 ; off-sheet EDP_TX1_N
EDP_TX1_P: C203.2 ; off-sheet EDP_TX1_P
EDP_TX2_N: C206.2 ; off-sheet EDP_TX2_N
EDP_TX2_P: C205.2 ; off-sheet EDP_TX2_P
EDP_TX3_N: C208.2 ; off-sheet EDP_TX3_N
EDP_TX3_P: C207.2 ; off-sheet EDP_TX3_P
EDPAUX_N: U8.A28(EDP_AUXN) ; off-sheet EDPAUX_N
EDPAUX_P: U8.B28(EDP_AUXP) ; off-sheet EDPAUX_P
HDMI_HPD: D1.K R29.2 U8.AE15(HDMI_HPD) ; off-sheet HDMI_HPD
HDMI_TX0_N: U8.AL17(HDMI_TX0N) ; off-sheet HDMI_TX0_N
HDMI_TX0_P: U8.AK17(HDMI_TX0P) ; off-sheet HDMI_TX0_P
HDMI_TX1_N: U8.AL18(HDMI_TX1N) ; off-sheet HDMI_TX1_N
HDMI_TX1_P: U8.AK18(HDMI_TX1P) ; off-sheet HDMI_TX1_P
HDMI_TX2_N: U8.AL19(HDMI_TX2N) ; off-sheet HDMI_TX2_N
HDMI_TX2_P: U8.AK19(HDMI_TX2P) ; off-sheet HDMI_TX2_P
HDMI_TXCLK_N: U8.AL16(HDMI_TCN) ; off-sheet HDMI_TXCLK_N
HDMI_TXCLK_P: U8.AK16(HDMI_TCP) ; off-sheet HDMI_TXCLK_P
MIPI_TX0_CLK_N: U8.AH12(MIPI_TX0_CLKN) ; off-sheet MIPI_TX0_CLK_N
MIPI_TX0_CLK_P: U8.AG12(MIPI_TX0_CLKP) ; off-sheet MIPI_TX0_CLK_P
MIPI_TX0_D0_N: U8.AH15(MIPI_TX0_D0N) ; off-sheet MIPI_TX0_D0_N
MIPI_TX0_D0_P: U8.AG15(MIPI_TX0_D0P) ; off-sheet MIPI_TX0_D0_P
MIPI_TX0_D1_N: U8.AH14(MIPI_TX0_D1N) ; off-sheet MIPI_TX0_D1_N
MIPI_TX0_D1_P: U8.AG14(MIPI_TX0_D1P) ; off-sheet MIPI_TX0_D1_P
MIPI_TX0_D2_N: U8.AH11(MIPI_TX0_D2N) ; off-sheet MIPI_TX0_D2_N
MIPI_TX0_D2_P: U8.AG11(MIPI_TX0_D2P) ; off-sheet MIPI_TX0_D2_P
MIPI_TX0_D3_N: U8.AH9(MIPI_TX0_D3N) ; off-sheet MIPI_TX0_D3_N
MIPI_TX0_D3_P: U8.AG9(MIPI_TX0_D3P) ; off-sheet MIPI_TX0_D3_P
TX0_N: C202.1 U8.A29(EDP_TX0N)
TX0_P: C201.1 U8.B29(EDP_TX0P)
TX1_N: C204.1 U8.A30(EDP_TX1N)
TX1_P: C203.1 U8.B30(EDP_TX1P)
TX2_N: C206.1 U8.C31(EDP_TX2N)
TX2_P: C205.1 U8.C30(EDP_TX2P)
TX3_N: C208.1 U8.D31(EDP_TX3N)
TX3_P: C207.1 U8.D30(EDP_TX3P)
NetR28_1: R28.1 U8.AF15(HDMI_REXT)
NetR30_1: R30.1 U8.G21(EDP_REXT)
NetR31_1: R31.1 U8.AF12(MIPI_TX0_REXT)

Not connected (* = marked no-connect by the designer): U8 G20(EDP_DC_TP)* H21(EDP_CLK24M_IN)*

### Layout directives
differential pair; differential pair class DIFF100_HDMI: HDMI_TX0_N, HDMI_TX0_P, HDMI_TX1_N, HDMI_TX1_P, HDMI_TX2_N, HDMI_TX2_P, HDMI_TXCLK_N, HDMI_TXCLK_P
net class HDMI SIG. GROUP; net class DIFF_PAIR_CLASS: HDMI_TX0_N, HDMI_TX0_P, HDMI_TX1_N, HDMI_TX1_P, HDMI_TX2_N, HDMI_TX2_P, HDMI_TXCLK_N, HDMI_TXCLK_P
net class HDMI SIG. GROUP: HDMI_HPD, NetR28_1
net class MIPI-DSI0 SIG. GROUP; net class DIFF_PAIR_CLASS: MIPI_TX0_CLK_N, MIPI_TX0_CLK_P, MIPI_TX0_D0_N, MIPI_TX0_D0_P, MIPI_TX0_D1_N, MIPI_TX0_D1_P, MIPI_TX0_D2_N, MIPI_TX0_D2_P, MIPI_TX0_D3_N, MIPI_TX0_D3_P
differential pair; differential pair class DIFF100_MIPI-DSI: MIPI_TX0_CLK_N, MIPI_TX0_CLK_P, MIPI_TX0_D0_N, MIPI_TX0_D0_P, MIPI_TX0_D1_N, MIPI_TX0_D1_P, MIPI_TX0_D2_N, MIPI_TX0_D2_P, MIPI_TX0_D3_N, MIPI_TX0_D3_P
net class EDP SIG. GROUP; net class DIFF_PAIR_CLASS: EDP_TX0_N, EDP_TX0_P, EDP_TX1_N, EDP_TX1_P, EDP_TX2_N, EDP_TX2_P, EDP_TX3_N, EDP_TX3_P, EDPAUX_N, EDPAUX_P, NetR30_1, TX0_N, TX0_P, TX1_N, TX1_P, TX2_N, TX2_P, TX3_N, TX3_P
differential pair; differential pair class DIFF90_EDP: EDP_TX0_N, EDP_TX0_P, EDP_TX1_N, EDP_TX1_P, EDP_TX2_N, EDP_TX2_P, EDP_TX3_N, EDP_TX3_P, EDPAUX_N, EDPAUX_P, TX0_N, TX0_P, TX1_N, TX1_P, TX2_N, TX2_P, TX3_N, TX3_P
net class MIPI-DSI0 SIG. GROUP: NetR31_1

### Notes on the sheet
- Title
- Company
- Product Number
- Subtitle
- Project Revision Date
- Template Revision Date
- Project Revision
- Template Revision
- Size
- Page
- A4
- Total
- Checked By
- Drawn By
- 22.07.2025
- Talha ÇETİNCEVİZ
- A

### Library data of the parts
C201-C209 C211 C213-C215 = CAP_100nF-25V-10%-0201: as C184 on sheet RK3399_PMU; Case/Package: 0201; Supplier-1: Digikey
C210 C212 = CAP_1uF-16V-10%-0201: as C191 on sheet RK3399_PMU; Case/Package: 0201; Supplier-1: Digikey
D1 = DIO-Z_3.3V-300mW-SOD-523: Zener Diode 3.3V 300mW ±6% Surface Mount SOD-523; Manufacturer: Diodes Incorporated; Manufacturer Part Number: BZT52C3V3T-7; Case/Package: SOD523; Supplier-1: Digikey
R28 = RES_1.62K-0.05W-1%-0201: 1.62 kOhms ±1% 0.05W, 1/20W Chip Resistor 0201 (0603 Metric) Automotive AEC-Q200 Thick Film; Manufacturer: Panasonic Electronic Components; Manufacturer Part Number: ERJ-1GNF1621C; Case/Package: 0201; Supplier-1: Digikey
R29 = RES_10K-0.05W-1%-0201: as R27 on sheet RK3399_EMMC_ADC_PCIE; Case/Package: 0201; Supplier-1: Digikey
R30 = RES_6.04K-0.05W-1%-0201: 6.04 kOhms ±1% 0.05W, 1/20W Chip Resistor 0201 (0603 Metric) Thick Film; Manufacturer: Panasonic Electronic Components; Manufacturer Part Number: ERJ-1GEF6041C; Case/Package: 0201; Supplier-1: Digikey
R31 = RES_4.02K-0.05W-1%-0201: 4.02 kOhms ±1% 0.05W, 1/20W Chip Resistor 0201 (0603 Metric) Thick Film; Manufacturer: Yageo; Manufacturer Part Number: RC0201FR-074K02L; Case/Package: 0201; Supplier-1: Digikey
U8 = IC_RK3399-FCBGA828: as U8 on sheet RK3399_PMU; Manufacturer Part Number: RK3399; Case/Package: FCBGA828; Supplier-1: Rockchip

## Sheet RK3399_USB2_TYPEC_USIC.SchDoc
size A4; Date: 07.08.2025; CheckedBy: Own Check; CompanyName: No Company; DocumentNumber: ELK.PCB.0005.0005.A.A; Revision: V0.0.1; SheetNumber: 13; SheetTotal: 22
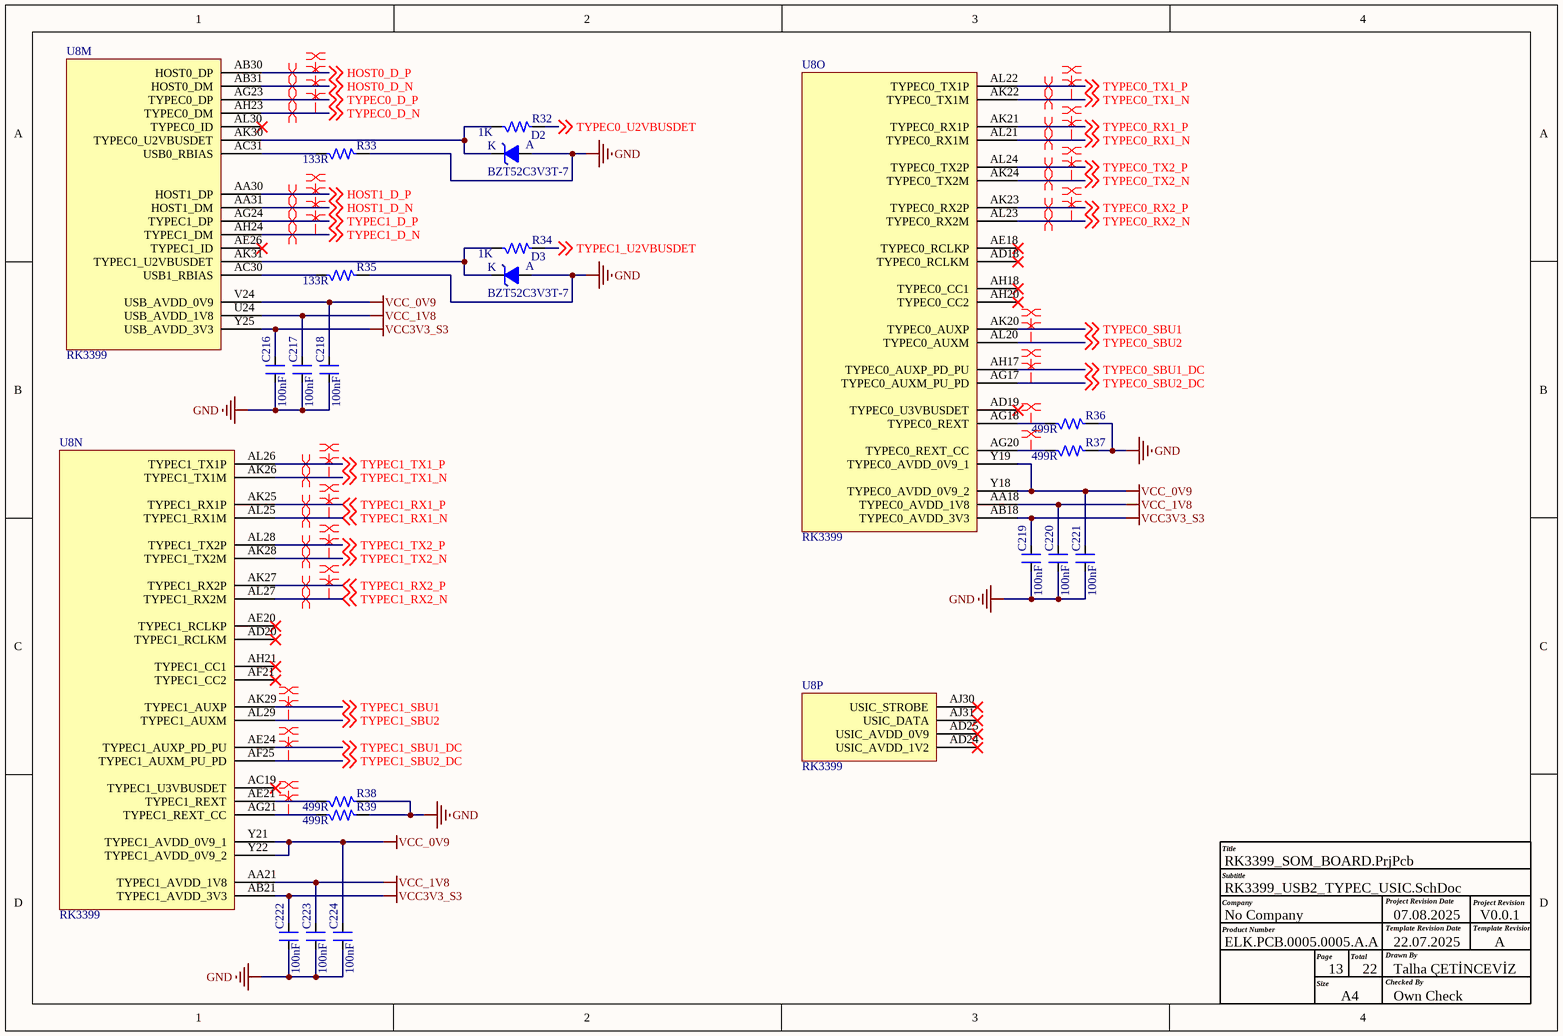
[diagram p11: RK3399_USB2_TYPEC_USIC.SchDoc]

### Parts
C216  100nF  [CAP_0201]
C217  100nF  [CAP_0201]
C218  100nF  [CAP_0201]
C219  100nF  [CAP_0201]
C220  100nF  [CAP_0201]
C221  100nF  [CAP_0201]
C222  100nF  [CAP_0201]
C223  100nF  [CAP_0201]
C224  100nF  [CAP_0201]
D2  BZT52C3V3T-7  [DIO_SOD523]
D3  BZT52C3V3T-7  [DIO_SOD523]
R32  1K  [RES_0201]
R33  133R  [RES_0201]
R34  1K  [RES_0201]
R35  133R  [RES_0201]
R36  499R  [RES_0201]
R37  499R  [RES_0201]
R38  499R  [RES_0201]
R39  499R  [RES_0201]
U8  RK3399  [FBGA828_23_826X826]  (parts M,N,O,P of 24)

### Nets
GND: C216.1 C217.1 C218.1 C219.1 C220.1 C221.1 C222.1 C223.1 C224.1 D2.A D3.A R33.2 R35.2 R36.2 R37.2 R38.2 R39.2
VCC3V3_S3: C216.2 C219.2 C222.2 U8.AB18(TYPEC0_AVDD_3V3) U8.AB21(TYPEC1_AVDD_3V3) U8.Y25(USB_AVDD_3V3)
VCC_0V9: C218.2 C221.2 C224.2 U8.V24(USB_AVDD_0V9) U8.Y18(TYPEC0_AVDD_0V9_2) U8.Y19(TYPEC0_AVDD_0V9_1) U8.Y21(TYPEC1_AVDD_0V9_1) U8.Y22(TYPEC1_AVDD_0V9_2)
VCC_1V8: C217.2 C220.2 C223.2 U8.AA18(TYPEC0_AVDD_1V8) U8.AA21(TYPEC1_AVDD_1V8) U8.U24(USB_AVDD_1V8)
HOST0_D_N: U8.AB31(HOST0_DM) ; off-sheet HOST0_D_N
HOST0_D_P: U8.AB30(HOST0_DP) ; off-sheet HOST0_D_P
HOST1_D_N: U8.AA31(HOST1_DM) ; off-sheet HOST1_D_N
HOST1_D_P: U8.AA30(HOST1_DP) ; off-sheet HOST1_D_P
TYPEC0_D_N: U8.AH23(TYPEC0_DM) ; off-sheet TYPEC0_D_N
TYPEC0_D_P: U8.AG23(TYPEC0_DP) ; off-sheet TYPEC0_D_P
TYPEC0_RX1_N: U8.AL21(TYPEC0_RX1M) ; off-sheet TYPEC0_RX1_N
TYPEC0_RX1_P: U8.AK21(TYPEC0_RX1P) ; off-sheet TYPEC0_RX1_P
TYPEC0_RX2_N: U8.AL23(TYPEC0_RX2M) ; off-sheet TYPEC0_RX2_N
TYPEC0_RX2_P: U8.AK23(TYPEC0_RX2P) ; off-sheet TYPEC0_RX2_P
TYPEC0_SBU1: U8.AK20(TYPEC0_AUXP) ; off-sheet TYPEC0_SBU1
TYPEC0_SBU1_DC: U8.AH17(TYPEC0_AUXP_PD_PU) ; off-sheet TYPEC0_SBU1_DC
TYPEC0_SBU2: U8.AL20(TYPEC0_AUXM) ; off-sheet TYPEC0_SBU2
TYPEC0_SBU2_DC: U8.AG17(TYPEC0_AUXM_PU_PD) ; off-sheet TYPEC0_SBU2_DC
TYPEC0_TX1_N: U8.AK22(TYPEC0_TX1M) ; off-sheet TYPEC0_TX1_N
TYPEC0_TX1_P: U8.AL22(TYPEC0_TX1P) ; off-sheet TYPEC0_TX1_P
TYPEC0_TX2_N: U8.AK24(TYPEC0_TX2M) ; off-sheet TYPEC0_TX2_N
TYPEC0_TX2_P: U8.AL24(TYPEC0_TX2P) ; off-sheet TYPEC0_TX2_P
TYPEC0_U2VBUSDET: R32.2 ; off-sheet TYPEC0_U2VBUSDET
TYPEC1_D_N: U8.AH24(TYPEC1_DM) ; off-sheet TYPEC1_D_N
TYPEC1_D_P: U8.AG24(TYPEC1_DP) ; off-sheet TYPEC1_D_P
TYPEC1_RX1_N: U8.AL25(TYPEC1_RX1M) ; off-sheet TYPEC1_RX1_N
TYPEC1_RX1_P: U8.AK25(TYPEC1_RX1P) ; off-sheet TYPEC1_RX1_P
TYPEC1_RX2_N: U8.AL27(TYPEC1_RX2M) ; off-sheet TYPEC1_RX2_N
TYPEC1_RX2_P: U8.AK27(TYPEC1_RX2P) ; off-sheet TYPEC1_RX2_P
TYPEC1_SBU1: U8.AK29(TYPEC1_AUXP) ; off-sheet TYPEC1_SBU1
TYPEC1_SBU1_DC: U8.AE24(TYPEC1_AUXP_PD_PU) ; off-sheet TYPEC1_SBU1_DC
TYPEC1_SBU2: U8.AL29(TYPEC1_AUXM) ; off-sheet TYPEC1_SBU2
TYPEC1_SBU2_DC: U8.AF25(TYPEC1_AUXM_PU_PD) ; off-sheet TYPEC1_SBU2_DC
TYPEC1_TX1_N: U8.AK26(TYPEC1_TX1M) ; off-sheet TYPEC1_TX1_N
TYPEC1_TX1_P: U8.AL26(TYPEC1_TX1P) ; off-sheet TYPEC1_TX1_P
TYPEC1_TX2_N: U8.AK28(TYPEC1_TX2M) ; off-sheet TYPEC1_TX2_N
TYPEC1_TX2_P: U8.AL28(TYPEC1_TX2P) ; off-sheet TYPEC1_TX2_P
TYPEC1_U2VBUSDET: R34.2 ; off-sheet TYPEC1_U2VBUSDET
NetD2_K: D2.K R32.1 U8.AK30(TYPEC0_U2VBUSDET)
NetD3_K: D3.K R34.1 U8.AK31(TYPEC1_U2VBUSDET)
NetR33_1: R33.1 U8.AC31(USB0_RBIAS)
NetR35_1: R35.1 U8.AC30(USB1_RBIAS)
NetR36_1: R36.1 U8.AG18(TYPEC0_REXT)
NetR37_1: R37.1 U8.AG20(TYPEC0_REXT_CC)
NetR38_1: R38.1 U8.AE21(TYPEC1_REXT)
NetR39_1: R39.1 U8.AG21(TYPEC1_REXT_CC)

Not connected (* = marked no-connect by the designer): U8 AC19(TYPEC1_U3VBUSDET)* AD18(TYPEC0_RCLKM)* AD19(TYPEC0_U3VBUSDET)* AD20(TYPEC1_RCLKM)* AD24(USIC_AVDD_1V2)* AD25(USIC_AVDD_0V9)* AE18(TYPEC0_RCLKP)* AE20(TYPEC1_RCLKP)* AE26(TYPEC1_ID)* AF21(TYPEC1_CC2)* AH18(TYPEC0_CC1)* AH20(TYPEC0_CC2)* AH21(TYPEC1_CC1)* AJ30(USIC_STROBE)* AJ31(USIC_DATA)* AL30(TYPEC0_ID)*

### Layout directives
differential pair; differential pair class DIFF90_USB2.0: HOST0_D_N, HOST0_D_P, HOST1_D_N, HOST1_D_P
differential pair; differential pair class DIFF90_USBTYPEC: TYPEC0_D_N, TYPEC0_D_P, TYPEC0_RX1_N, TYPEC0_RX1_P, TYPEC0_RX2_N, TYPEC0_RX2_P, TYPEC0_TX1_N, TYPEC0_TX1_P, TYPEC0_TX2_N, TYPEC0_TX2_P, TYPEC1_D_N, TYPEC1_D_P, TYPEC1_RX1_N, TYPEC1_RX1_P, TYPEC1_RX2_N, TYPEC1_RX2_P, TYPEC1_TX1_N, TYPEC1_TX1_P, TYPEC1_TX2_N, TYPEC1_TX2_P
net class TYPEC0 SIG. GROUP; net class DIFF_PAIR_CLASS: TYPEC0_D_N, TYPEC0_D_P, TYPEC0_RX1_N, TYPEC0_RX1_P, TYPEC0_RX2_N, TYPEC0_RX2_P, TYPEC0_TX1_N, TYPEC0_TX1_P, TYPEC0_TX2_N, TYPEC0_TX2_P
net class USB2.0 SIG. GROUP; net class DIFF_PAIR_CLASS: HOST0_D_N, HOST0_D_P, HOST1_D_N, HOST1_D_P
net class TYPEC1 SIG. GROUP; net class DIFF_PAIR_CLASS: TYPEC1_D_N, TYPEC1_D_P, TYPEC1_RX1_N, TYPEC1_RX1_P, TYPEC1_RX2_N, TYPEC1_RX2_P, TYPEC1_TX1_N, TYPEC1_TX1_P, TYPEC1_TX2_N, TYPEC1_TX2_P
net class TYPEC1 SIG. GROUP: NetR38_1, NetR39_1, TYPEC1_SBU1, TYPEC1_SBU1_DC, TYPEC1_SBU2, TYPEC1_SBU2_DC
net class TYPEC0 SIG. GROUP: NetR36_1, NetR37_1, TYPEC0_SBU1, TYPEC0_SBU1_DC, TYPEC0_SBU2, TYPEC0_SBU2_DC

### Notes on the sheet
- Title
- Company
- Product Number
- Subtitle
- Project Revision Date
- Template Revision Date
- Project Revision
- Template Revision
- Size
- Page
- A4
- Total
- Checked By
- Drawn By
- 22.07.2025
- Talha ÇETİNCEVİZ
- A

### Library data of the parts
C216-C224 = CAP_100nF-25V-10%-0201: as C184 on sheet RK3399_PMU; Case/Package: 0201; Supplier-1: Digikey
D2 D3 = DIO-Z_3.3V-300mW-SOD-523: as D1 on sheet RK3399_EDP_CSI_HDMI; Manufacturer Part Number: BZT52C3V3T-7; Case/Package: SOD523; Supplier-1: Digikey
R32 R34 = RES_1K-0.05W-1%-0201: as R23 on sheet RK3399_PMU; Case/Package: 0201; Supplier-1: Digikey
R33 R35 = RES_133R-0.05W-1%-0201: 133 Ohms ±1% 0.05W, 1/20W Chip Resistor 0201 (0603 Metric) Automotive AEC-Q200 Thick Film; Manufacturer: Panasonic Electronic Components; Manufacturer Part Number: ERJ-1GNF1330C; Case/Package: 0201; Supplier-1: Digikey
R36-R39 = RES_499R-0.05W-1%-0201: 499 Ohms ±1% 0.05W, 1/20W Chip Resistor 0201 (0603 Metric) Thick Film; Manufacturer: Stackpole Electronics Inc; Manufacturer Part Number: RMCF0201FT499R; Case/Package: 0201; Supplier-1: Digikey
U8 = IC_RK3399-FCBGA828: as U8 on sheet RK3399_PMU; Manufacturer Part Number: RK3399; Case/Package: FCBGA828; Supplier-1: Rockchip

## Sheet RK3399_DVP_MIPI_CSI.SchDoc
size A4; Date: 07.08.2025; CheckedBy: Own Check; CompanyName: No Company; DocumentNumber: ELK.PCB.0005.0005.A.A; Revision: V0.0.1; SheetNumber: 14; SheetTotal: 22
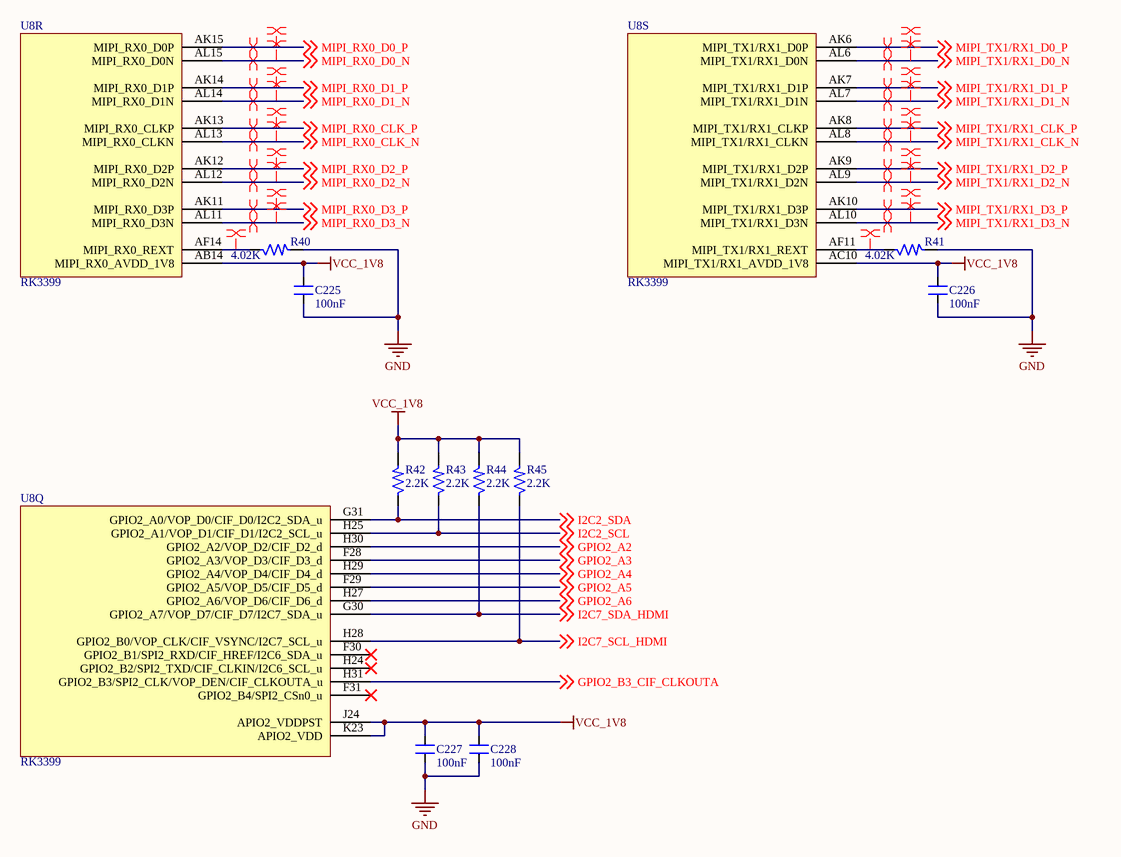
[diagram p12: RK3399_DVP_MIPI_CSI.SchDoc]

### Parts
C225  100nF  [CAP_0201]
C226  100nF  [CAP_0201]
C227  100nF  [CAP_0201]
C228  100nF  [CAP_0201]
R40  4.02K  [RES_0201]
R41  4.02K  [RES_0201]
R42  2.2K  [RES_0201]
R43  2.2K  [RES_0201]
R44  2.2K  [RES_0201]
R45  2.2K  [RES_0201]
U8  RK3399  [FBGA828_23_826X826]  (parts Q,R,S of 24)

### Nets
GND: C225.1 C226.1 C227.1 C228.1 R40.2 R41.2
VCC_1V8: C225.2 C226.2 C227.2 C228.2 R42.2 R43.2 R44.2 R45.2 U8.AB14(MIPI_RX0_AVDD_1V8) U8.AC10(MIPI_TX1/RX1_AVDD_1V8) U8.J24(APIO2_VDDPST) U8.K23(APIO2_VDD)
GPIO2_A2: U8.H30(GPIO2_A2/VOP_D2/CIF_D2_d) ; off-sheet GPIO2_A2
GPIO2_A3: U8.F28(GPIO2_A3/VOP_D3/CIF_D3_d) ; off-sheet GPIO2_A3
GPIO2_A4: U8.H29(GPIO2_A4/VOP_D4/CIF_D4_d) ; off-sheet GPIO2_A4
GPIO2_A5: U8.F29(GPIO2_A5/VOP_D5/CIF_D5_d) ; off-sheet GPIO2_A5
GPIO2_A6: U8.H27(GPIO2_A6/VOP_D6/CIF_D6_d) ; off-sheet GPIO2_A6
GPIO2_B3_CIF_CLKOUTA: U8.H31(GPIO2_B3/SPI2_CLK/VOP_DEN/CIF_CLKOUTA_u) ; off-sheet GPIO2_B3_CIF_CLKOUTA
I2C2_SCL: R43.1 U8.H25(GPIO2_A1/VOP_D1/CIF_D1/I2C2_SCL_u) ; off-sheet I2C2_SCL
I2C2_SDA: R42.1 U8.G31(GPIO2_A0/VOP_D0/CIF_D0/I2C2_SDA_u) ; off-sheet I2C2_SDA
I2C7_SCL_HDMI: R45.1 U8.H28(GPIO2_B0/VOP_CLK/CIF_VSYNC/I2C7_SCL_u) ; off-sheet I2C7_SCL_HDMI
I2C7_SDA_HDMI: R44.1 U8.G30(GPIO2_A7/VOP_D7/CIF_D7/I2C7_SDA_u) ; off-sheet I2C7_SDA_HDMI
MIPI_RX0_CLK_N: U8.AL13(MIPI_RX0_CLKN) ; off-sheet MIPI_RX0_CLK_N
MIPI_RX0_CLK_P: U8.AK13(MIPI_RX0_CLKP) ; off-sheet MIPI_RX0_CLK_P
MIPI_RX0_D0_N: U8.AL15(MIPI_RX0_D0N) ; off-sheet MIPI_RX0_D0_N
MIPI_RX0_D0_P: U8.AK15(MIPI_RX0_D0P) ; off-sheet MIPI_RX0_D0_P
MIPI_RX0_D1_N: U8.AL14(MIPI_RX0_D1N) ; off-sheet MIPI_RX0_D1_N
MIPI_RX0_D1_P: U8.AK14(MIPI_RX0_D1P) ; off-sheet MIPI_RX0_D1_P
MIPI_RX0_D2_N: U8.AL12(MIPI_RX0_D2N) ; off-sheet MIPI_RX0_D2_N
MIPI_RX0_D2_P: U8.AK12(MIPI_RX0_D2P) ; off-sheet MIPI_RX0_D2_P
MIPI_RX0_D3_N: U8.AL11(MIPI_RX0_D3N) ; off-sheet MIPI_RX0_D3_N
MIPI_RX0_D3_P: U8.AK11(MIPI_RX0_D3P) ; off-sheet MIPI_RX0_D3_P
MIPI_TX1/RX1_CLK_N: U8.AL8(MIPI_TX1/RX1_CLKN) ; off-sheet MIPI_TX1/RX1_CLK_N
MIPI_TX1/RX1_CLK_P: U8.AK8(MIPI_TX1/RX1_CLKP) ; off-sheet MIPI_TX1/RX1_CLK_P
MIPI_TX1/RX1_D0_N: U8.AL6(MIPI_TX1/RX1_D0N) ; off-sheet MIPI_TX1/RX1_D0_N
MIPI_TX1/RX1_D0_P: U8.AK6(MIPI_TX1/RX1_D0P) ; off-sheet MIPI_TX1/RX1_D0_P
MIPI_TX1/RX1_D1_N: U8.AL7(MIPI_TX1/RX1_D1N) ; off-sheet MIPI_TX1/RX1_D1_N
MIPI_TX1/RX1_D1_P: U8.AK7(MIPI_TX1/RX1_D1P) ; off-sheet MIPI_TX1/RX1_D1_P
MIPI_TX1/RX1_D2_N: U8.AL9(MIPI_TX1/RX1_D2N) ; off-sheet MIPI_TX1/RX1_D2_N
MIPI_TX1/RX1_D2_P: U8.AK9(MIPI_TX1/RX1_D2P) ; off-sheet MIPI_TX1/RX1_D2_P
MIPI_TX1/RX1_D3_N: U8.AL10(MIPI_TX1/RX1_D3N) ; off-sheet MIPI_TX1/RX1_D3_N
MIPI_TX1/RX1_D3_P: U8.AK10(MIPI_TX1/RX1_D3P) ; off-sheet MIPI_TX1/RX1_D3_P
NetR40_1: R40.1 U8.AF14(MIPI_RX0_REXT)
NetR41_1: R41.1 U8.AF11(MIPI_TX1/RX1_REXT)

Not connected (* = marked no-connect by the designer): U8 F30(GPIO2_B1/SPI2_RXD/CIF_HREF/I2C6_SDA_u)* F31(GPIO2_B4/SPI2_CSn0_u)* H24(GPIO2_B2/SPI2_TXD/CIF_CLKIN/I2C6_SCL_u)*

### Layout directives
net class MIPI-CSI0_SIG. GROUP; net class DIFF_PAIR_CLASS: MIPI_RX0_CLK_N, MIPI_RX0_CLK_P, MIPI_RX0_D0_N, MIPI_RX0_D0_P, MIPI_RX0_D1_N, MIPI_RX0_D1_P, MIPI_RX0_D2_N, MIPI_RX0_D2_P, MIPI_RX0_D3_N, MIPI_RX0_D3_P
differential pair; differential pair class DIFF100_MIPI-CSI: MIPI_RX0_CLK_N, MIPI_RX0_CLK_P, MIPI_RX0_D0_N, MIPI_RX0_D0_P, MIPI_RX0_D1_N, MIPI_RX0_D1_P, MIPI_RX0_D2_N, MIPI_RX0_D2_P, MIPI_RX0_D3_N, MIPI_RX0_D3_P, MIPI_TX1/RX1_CLK_N, MIPI_TX1/RX1_CLK_P, MIPI_TX1/RX1_D0_N, MIPI_TX1/RX1_D0_P, MIPI_TX1/RX1_D1_N, MIPI_TX1/RX1_D1_P, MIPI_TX1/RX1_D2_N, MIPI_TX1/RX1_D2_P, MIPI_TX1/RX1_D3_N, MIPI_TX1/RX1_D3_P
net class MIPI-CSI0_SIG. GROUP: NetR40_1
net class MIPI-CSI1_SIG. GROUP: NetR41_1
net class MIPI-CSI1_SIG. GROUP; net class DIFF_PAIR_CLASS: MIPI_TX1/RX1_CLK_N, MIPI_TX1/RX1_CLK_P, MIPI_TX1/RX1_D0_N, MIPI_TX1/RX1_D0_P, MIPI_TX1/RX1_D1_N, MIPI_TX1/RX1_D1_P, MIPI_TX1/RX1_D2_N, MIPI_TX1/RX1_D2_P, MIPI_TX1/RX1_D3_N, MIPI_TX1/RX1_D3_P

### Notes on the sheet
- Title
- Company
- Product Number
- Subtitle
- Project Revision Date
- Template Revision Date
- Project Revision
- Template Revision
- Size
- Page
- A4
- Total
- Checked By
- Drawn By
- 22.07.2025
- Talha ÇETİNCEVİZ
- A

### Library data of the parts
C225-C228 = CAP_100nF-25V-10%-0201: as C184 on sheet RK3399_PMU; Case/Package: 0201; Supplier-1: Digikey
R40 R41 = RES_4.02K-0.05W-1%-0201: as R31 on sheet RK3399_EDP_CSI_HDMI; Case/Package: 0201; Supplier-1: Digikey
R42-R45 = RES_2.2K-0.05W-1%-0201: 2.2 kOhms ±1% 0.05W, 1/20W Chip Resistor 0201 (0603 Metric) Thick Film; Manufacturer: Stackpole Electronics Inc; Manufacturer Part Number: RMCF0201FT2K20; Case/Package: 0201; Supplier-1: Digikey
U8 = IC_RK3399-FCBGA828: as U8 on sheet RK3399_PMU; Manufacturer Part Number: RK3399; Case/Package: FCBGA828; Supplier-1: Rockchip

## Sheet RK3399_RGMII_SDIO_SPI_GPIO.SchDoc
size A3; Date: 07.08.2025; CheckedBy: Own Check; CompanyName: No Company; DocumentNumber: ELK.PCB.0005.0005.A.A; Revision: V0.0.1; SheetNumber: 15; SheetTotal: 22
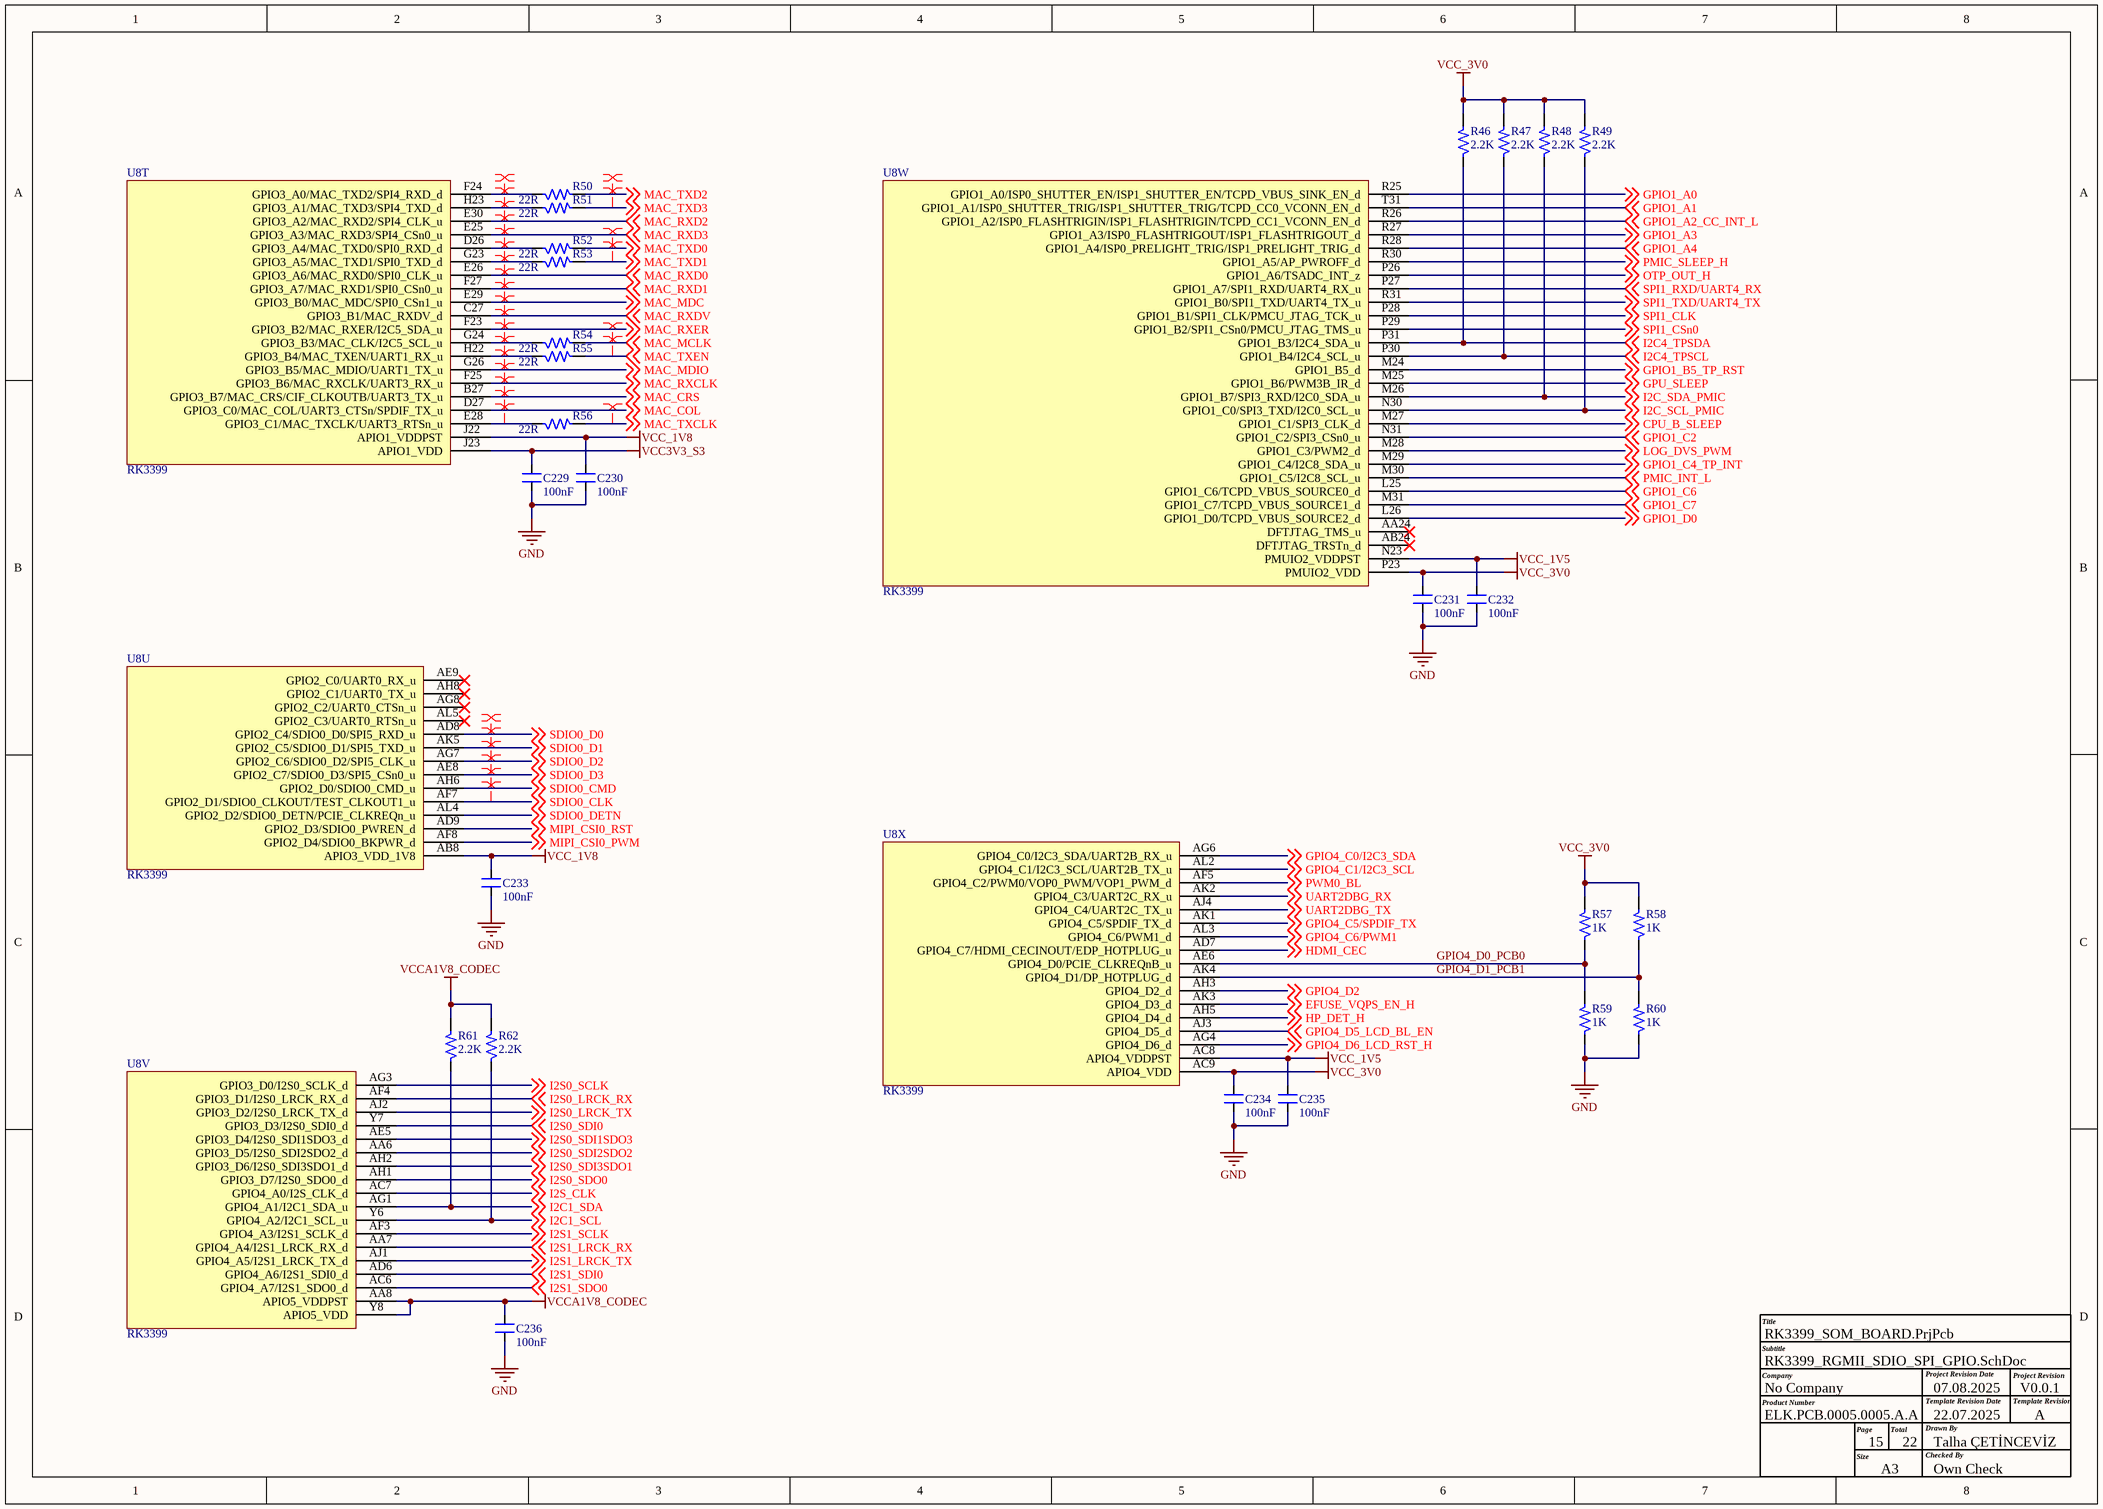
[diagram p13: RK3399_RGMII_SDIO_SPI_GPIO.SchDoc]

### Parts
C229  100nF  [CAP_0201]
C230  100nF  [CAP_0201]
C231  100nF  [CAP_0201]
C232  100nF  [CAP_0201]
C233  100nF  [CAP_0201]
C234  100nF  [CAP_0201]
C235  100nF  [CAP_0201]
C236  100nF  [CAP_0201]
R46  2.2K  [RES_0201]
R47  2.2K  [RES_0201]
R48  2.2K  [RES_0201]
R49  2.2K  [RES_0201]
R50  22R  [RES_0201]
R51  22R  [RES_0201]
R52  22R  [RES_0201]
R53  22R  [RES_0201]
R54  22R  [RES_0201]
R55  22R  [RES_0201]
R56  22R  [RES_0201]
R57  1K  [RES_0201]
R58  1K  [RES_0201]
R59  1K  [RES_0201]
R60  1K  [RES_0201]
R61  2.2K  [RES_0201]
R62  2.2K  [RES_0201]
U8  RK3399  [FBGA828_23_826X826]  (parts T,U,V,W,X of 24)

### Nets
GND: C229.1 C230.1 C231.1 C232.1 C233.1 C234.1 C235.1 C236.1 R59.1 R60.1
VCC3V3_S3: C229.2 U8.J23(APIO1_VDD)
VCC_1V5: C232.2 C235.2 U8.AC8(APIO4_VDDPST) U8.N23(PMUIO2_VDDPST)
VCC_1V8: C230.2 C233.2 U8.AB8(APIO3_VDD_1V8) U8.J22(APIO1_VDDPST)
VCC_3V0: C231.2 C234.2 R46.2 R47.2 R48.2 R49.2 R57.2 R58.2 U8.AC9(APIO4_VDD) U8.P23(PMUIO2_VDD)
VCCA1V8_CODEC: C236.2 R61.2 R62.2 U8.AA8(APIO5_VDDPST) U8.Y8(APIO5_VDD)
CPU_B_SLEEP: U8.M27(GPIO1_C1/SPI3_CLK_d) ; off-sheet CPU_B_SLEEP
EFUSE_VQPS_EN_H: U8.AK3(GPIO4_D3_d) ; off-sheet EFUSE_VQPS_EN_H
GPIO1_A0: U8.R25(GPIO1_A0/ISP0_SHUTTER_EN/ISP1_SHUTTER_EN/TCPD_VBUS_SINK_EN_d) ; off-sheet GPIO1_A0
GPIO1_A1: U8.T31(GPIO1_A1/ISP0_SHUTTER_TRIG/ISP1_SHUTTER_TRIG/TCPD_CC0_VCONN_EN_d) ; off-sheet GPIO1_A1
GPIO1_A2_CC_INT_L: U8.R26(GPIO1_A2/ISP0_FLASHTRIGIN/ISP1_FLASHTRIGIN/TCPD_CC1_VCONN_EN_d) ; off-sheet GPIO1_A2_CC_INT_L
GPIO1_A3: U8.R27(GPIO1_A3/ISP0_FLASHTRIGOUT/ISP1_FLASHTRIGOUT_d) ; off-sheet GPIO1_A3
GPIO1_A4: U8.R28(GPIO1_A4/ISP0_PRELIGHT_TRIG/ISP1_PRELIGHT_TRIG_d) ; off-sheet GPIO1_A4
GPIO1_B5_TP_RST: U8.M24(GPIO1_B5_d) ; off-sheet GPIO1_B5_TP_RST
GPIO1_C2: U8.N31(GPIO1_C2/SPI3_CSn0_u) ; off-sheet GPIO1_C2
GPIO1_C4_TP_INT: U8.M29(GPIO1_C4/I2C8_SDA_u) ; off-sheet GPIO1_C4_TP_INT
GPIO1_C6: U8.L25(GPIO1_C6/TCPD_VBUS_SOURCE0_d) ; off-sheet GPIO1_C6
GPIO1_C7: U8.M31(GPIO1_C7/TCPD_VBUS_SOURCE1_d) ; off-sheet GPIO1_C7
GPIO1_D0: U8.L26(GPIO1_D0/TCPD_VBUS_SOURCE2_d) ; off-sheet GPIO1_D0
GPIO4_C0/I2C3_SDA: U8.AG6(GPIO4_C0/I2C3_SDA/UART2B_RX_u) ; off-sheet GPIO4_C0/I2C3_SDA
GPIO4_C1/I2C3_SCL: U8.AL2(GPIO4_C1/I2C3_SCL/UART2B_TX_u) ; off-sheet GPIO4_C1/I2C3_SCL
GPIO4_C5/SPDIF_TX: U8.AK1(GPIO4_C5/SPDIF_TX_d) ; off-sheet GPIO4_C5/SPDIF_TX
GPIO4_C6/PWM1: U8.AL3(GPIO4_C6/PWM1_d) ; off-sheet GPIO4_C6/PWM1
GPIO4_D0_PCB0: R57.1 R59.2 U8.AE6(GPIO4_D0/PCIE_CLKREQnB_u)
GPIO4_D1_PCB1: R58.1 R60.2 U8.AK4(GPIO4_D1/DP_HOTPLUG_d)
GPIO4_D2: U8.AH3(GPIO4_D2_d) ; off-sheet GPIO4_D2
GPIO4_D5_LCD_BL_EN: U8.AJ3(GPIO4_D5_d) ; off-sheet GPIO4_D5_LCD_BL_EN
GPIO4_D6_LCD_RST_H: U8.AG4(GPIO4_D6_d) ; off-sheet GPIO4_D6_LCD_RST_H
GPU_SLEEP: U8.M25(GPIO1_B6/PWM3B_IR_d) ; off-sheet GPU_SLEEP
HDMI_CEC: U8.AD7(GPIO4_C7/HDMI_CECINOUT/EDP_HOTPLUG_u) ; off-sheet HDMI_CEC
HP_DET_H: U8.AH5(GPIO4_D4_d) ; off-sheet HP_DET_H
I2C1_SCL: R62.1 U8.Y6(GPIO4_A2/I2C1_SCL_u) ; off-sheet I2C1_SCL
I2C1_SDA: R61.1 U8.AG1(GPIO4_A1/I2C1_SDA_u) ; off-sheet I2C1_SDA
I2C4_TPSCL: R47.1 U8.P30(GPIO1_B4/I2C4_SCL_u) ; off-sheet I2C4_TPSCL
I2C4_TPSDA: R46.1 U8.P31(GPIO1_B3/I2C4_SDA_u) ; off-sheet I2C4_TPSDA
I2C_SCL_PMIC: R49.1 U8.N30(GPIO1_C0/SPI3_TXD/I2C0_SCL_u) ; off-sheet I2C_SCL_PMIC
I2C_SDA_PMIC: R48.1 U8.M26(GPIO1_B7/SPI3_RXD/I2C0_SDA_u) ; off-sheet I2C_SDA_PMIC
I2S0_LRCK_RX: U8.AF4(GPIO3_D1/I2S0_LRCK_RX_d) ; off-sheet I2S0_LRCK_RX
I2S0_LRCK_TX: U8.AJ2(GPIO3_D2/I2S0_LRCK_TX_d) ; off-sheet I2S0_LRCK_TX
I2S0_SCLK: U8.AG3(GPIO3_D0/I2S0_SCLK_d) ; off-sheet I2S0_SCLK
I2S0_SDI0: U8.Y7(GPIO3_D3/I2S0_SDI0_d) ; off-sheet I2S0_SDI0
I2S0_SDI1SDO3: U8.AE5(GPIO3_D4/I2S0_SDI1SDO3_d) ; off-sheet I2S0_SDI1SDO3
I2S0_SDI2SDO2: U8.AA6(GPIO3_D5/I2S0_SDI2SDO2_d) ; off-sheet I2S0_SDI2SDO2
I2S0_SDI3SDO1: U8.AH2(GPIO3_D6/I2S0_SDI3SDO1_d) ; off-sheet I2S0_SDI3SDO1
I2S0_SDO0: U8.AH1(GPIO3_D7/I2S0_SDO0_d) ; off-sheet I2S0_SDO0
I2S1_LRCK_RX: U8.AA7(GPIO4_A4/I2S1_LRCK_RX_d) ; off-sheet I2S1_LRCK_RX
I2S1_LRCK_TX: U8.AJ1(GPIO4_A5/I2S1_LRCK_TX_d) ; off-sheet I2S1_LRCK_TX
I2S1_SCLK: U8.AF3(GPIO4_A3/I2S1_SCLK_d) ; off-sheet I2S1_SCLK
I2S1_SDI0: U8.AD6(GPIO4_A6/I2S1_SDI0_d) ; off-sheet I2S1_SDI0
I2S1_SDO0: U8.AC6(GPIO4_A7/I2S1_SDO0_d) ; off-sheet I2S1_SDO0
I2S_CLK: U8.AC7(GPIO4_A0/I2S_CLK_d) ; off-sheet I2S_CLK
LOG_DVS_PWM: U8.M28(GPIO1_C3/PWM2_d) ; off-sheet LOG_DVS_PWM
MAC_COL: U8.D27(GPIO3_C0/MAC_COL/UART3_CTSn/SPDIF_TX_u) ; off-sheet MAC_COL
MAC_CRS: U8.B27(GPIO3_B7/MAC_CRS/CIF_CLKOUTB/UART3_TX_u) ; off-sheet MAC_CRS
MAC_MCLK: R54.2 ; off-sheet MAC_MCLK
MAC_MDC: U8.E29(GPIO3_B0/MAC_MDC/SPI0_CSn1_u) ; off-sheet MAC_MDC
MAC_MDIO: U8.G26(GPIO3_B5/MAC_MDIO/UART1_TX_u) ; off-sheet MAC_MDIO
MAC_RXCLK: U8.F25(GPIO3_B6/MAC_RXCLK/UART3_RX_u) ; off-sheet MAC_RXCLK
MAC_RXD0: U8.E26(GPIO3_A6/MAC_RXD0/SPI0_CLK_u) ; off-sheet MAC_RXD0
MAC_RXD1: U8.F27(GPIO3_A7/MAC_RXD1/SPI0_CSn0_u) ; off-sheet MAC_RXD1
MAC_RXD2: U8.E30(GPIO3_A2/MAC_RXD2/SPI4_CLK_u) ; off-sheet MAC_RXD2
MAC_RXD3: U8.E25(GPIO3_A3/MAC_RXD3/SPI4_CSn0_u) ; off-sheet MAC_RXD3
MAC_RXDV: U8.C27(GPIO3_B1/MAC_RXDV_d) ; off-sheet MAC_RXDV
MAC_RXER: U8.F23(GPIO3_B2/MAC_RXER/I2C5_SDA_u) ; off-sheet MAC_RXER
MAC_TXCLK: R56.2 ; off-sheet MAC_TXCLK
MAC_TXD0: R52.2 ; off-sheet MAC_TXD0
MAC_TXD1: R53.2 ; off-sheet MAC_TXD1
MAC_TXD2: R50.2 ; off-sheet MAC_TXD2
MAC_TXD3: R51.2 ; off-sheet MAC_TXD3
MAC_TXEN: R55.2 ; off-sheet MAC_TXEN
MIPI_CSI0_PWM: U8.AF8(GPIO2_D4/SDIO0_BKPWR_d) ; off-sheet MIPI_CSI0_PWM
MIPI_CSI0_RST: U8.AD9(GPIO2_D3/SDIO0_PWREN_d) ; off-sheet MIPI_CSI0_RST
OTP_OUT_H: U8.P26(GPIO1_A6/TSADC_INT_z) ; off-sheet OTP_OUT_H
PMIC_INT_L: U8.M30(GPIO1_C5/I2C8_SCL_u) ; off-sheet PMIC_INT_L
PMIC_SLEEP_H: U8.R30(GPIO1_A5/AP_PWROFF_d) ; off-sheet PMIC_SLEEP_H
PWM0_BL: U8.AF5(GPIO4_C2/PWM0/VOP0_PWM/VOP1_PWM_d) ; off-sheet PWM0_BL
SDIO0_CLK: U8.AF7(GPIO2_D1/SDIO0_CLKOUT/TEST_CLKOUT1_u) ; off-sheet SDIO0_CLK
SDIO0_CMD: U8.AH6(GPIO2_D0/SDIO0_CMD_u) ; off-sheet SDIO0_CMD
SDIO0_D0: U8.AD8(GPIO2_C4/SDIO0_D0/SPI5_RXD_u) ; off-sheet SDIO0_D0
SDIO0_D1: U8.AK5(GPIO2_C5/SDIO0_D1/SPI5_TXD_u) ; off-sheet SDIO0_D1
SDIO0_D2: U8.AG7(GPIO2_C6/SDIO0_D2/SPI5_CLK_u) ; off-sheet SDIO0_D2
SDIO0_D3: U8.AE8(GPIO2_C7/SDIO0_D3/SPI5_CSn0_u) ; off-sheet SDIO0_D3
SDIO0_DETN: U8.AL4(GPIO2_D2/SDIO0_DETN/PCIE_CLKREQn_u) ; off-sheet SDIO0_DETN
SPI1_CLK: U8.P28(GPIO1_B1/SPI1_CLK/PMCU_JTAG_TCK_u) ; off-sheet SPI1_CLK
SPI1_CSn0: U8.P29(GPIO1_B2/SPI1_CSn0/PMCU_JTAG_TMS_u) ; off-sheet SPI1_CSn0
SPI1_RXD/UART4_RX: U8.P27(GPIO1_A7/SPI1_RXD/UART4_RX_u) ; off-sheet SPI1_RXD/UART4_RX
SPI1_TXD/UART4_TX: U8.R31(GPIO1_B0/SPI1_TXD/UART4_TX_u) ; off-sheet SPI1_TXD/UART4_TX
UART2DBG_RX: U8.AK2(GPIO4_C3/UART2C_RX_u) ; off-sheet UART2DBG_RX
UART2DBG_TX: U8.AJ4(GPIO4_C4/UART2C_TX_u) ; off-sheet UART2DBG_TX
NetR50_1: R50.1 U8.F24(GPIO3_A0/MAC_TXD2/SPI4_RXD_d)
NetR51_1: R51.1 U8.H23(GPIO3_A1/MAC_TXD3/SPI4_TXD_d)
NetR52_1: R52.1 U8.D26(GPIO3_A4/MAC_TXD0/SPI0_RXD_d)
NetR53_1: R53.1 U8.G23(GPIO3_A5/MAC_TXD1/SPI0_TXD_d)
NetR54_1: R54.1 U8.G24(GPIO3_B3/MAC_CLK/I2C5_SCL_u)
NetR55_1: R55.1 U8.H22(GPIO3_B4/MAC_TXEN/UART1_RX_u)
NetR56_1: R56.1 U8.E28(GPIO3_C1/MAC_TXCLK/UART3_RTSn_u)

Not connected (* = marked no-connect by the designer): U8 AA24(DFTJTAG_TMS_u)* AB24(DFTJTAG_TRSTn_d)* AE9(GPIO2_C0/UART0_RX_u)* AG8(GPIO2_C2/UART0_CTSn_u)* AH8(GPIO2_C1/UART0_TX_u)* AL5(GPIO2_C3/UART0_RTSn_u)*

### Layout directives
net class 50OHM_MAC: MAC_COL, MAC_CRS, MAC_MCLK, MAC_MDC, MAC_MDIO, MAC_RXCLK, MAC_RXD0, MAC_RXD1, MAC_RXD2, MAC_RXD3, MAC_RXDV, MAC_RXER, MAC_TXCLK, MAC_TXD0, MAC_TXD1, MAC_TXD2, MAC_TXD3, MAC_TXEN, NetR50_1, NetR51_1, NetR52_1, NetR53_1, NetR54_1, NetR55_1, NetR56_1
net class 50OHM_SDIO: SDIO0_CLK, SDIO0_CMD, SDIO0_D0, SDIO0_D1, SDIO0_D2, SDIO0_D3

### Notes on the sheet
- Title
- Company
- Product Number
- Subtitle
- Project Revision Date
- Template Revision Date
- Project Revision
- Template Revision
- Size
- Page
- A3
- Total
- Checked By
- Drawn By
- 22.07.2025
- Talha ÇETİNCEVİZ
- A

### Library data of the parts
C229-C236 = CAP_100nF-25V-10%-0201: as C184 on sheet RK3399_PMU; Case/Package: 0201; Supplier-1: Digikey
R46-R49 R61 R62 = RES_2.2K-0.05W-1%-0201: as R42 on sheet RK3399_DVP_MIPI_CSI; Case/Package: 0201; Supplier-1: Digikey
R50-R56 = RES_22R-0.05W-1%-0201: as R26 on sheet RK3399_EMMC_ADC_PCIE; Case/Package: 0201; Supplier-1: Digikey
R57-R60 = RES_1K-0.05W-1%-0201: as R23 on sheet RK3399_PMU; Case/Package: 0201; Supplier-1: Digikey
U8 = IC_RK3399-FCBGA828: as U8 on sheet RK3399_PMU; Manufacturer Part Number: RK3399; Case/Package: FCBGA828; Supplier-1: Rockchip